# EAGLE schematic bitfury_h-card-v1.2 (EAGLE 6.2)

## Sheet 1 of 3
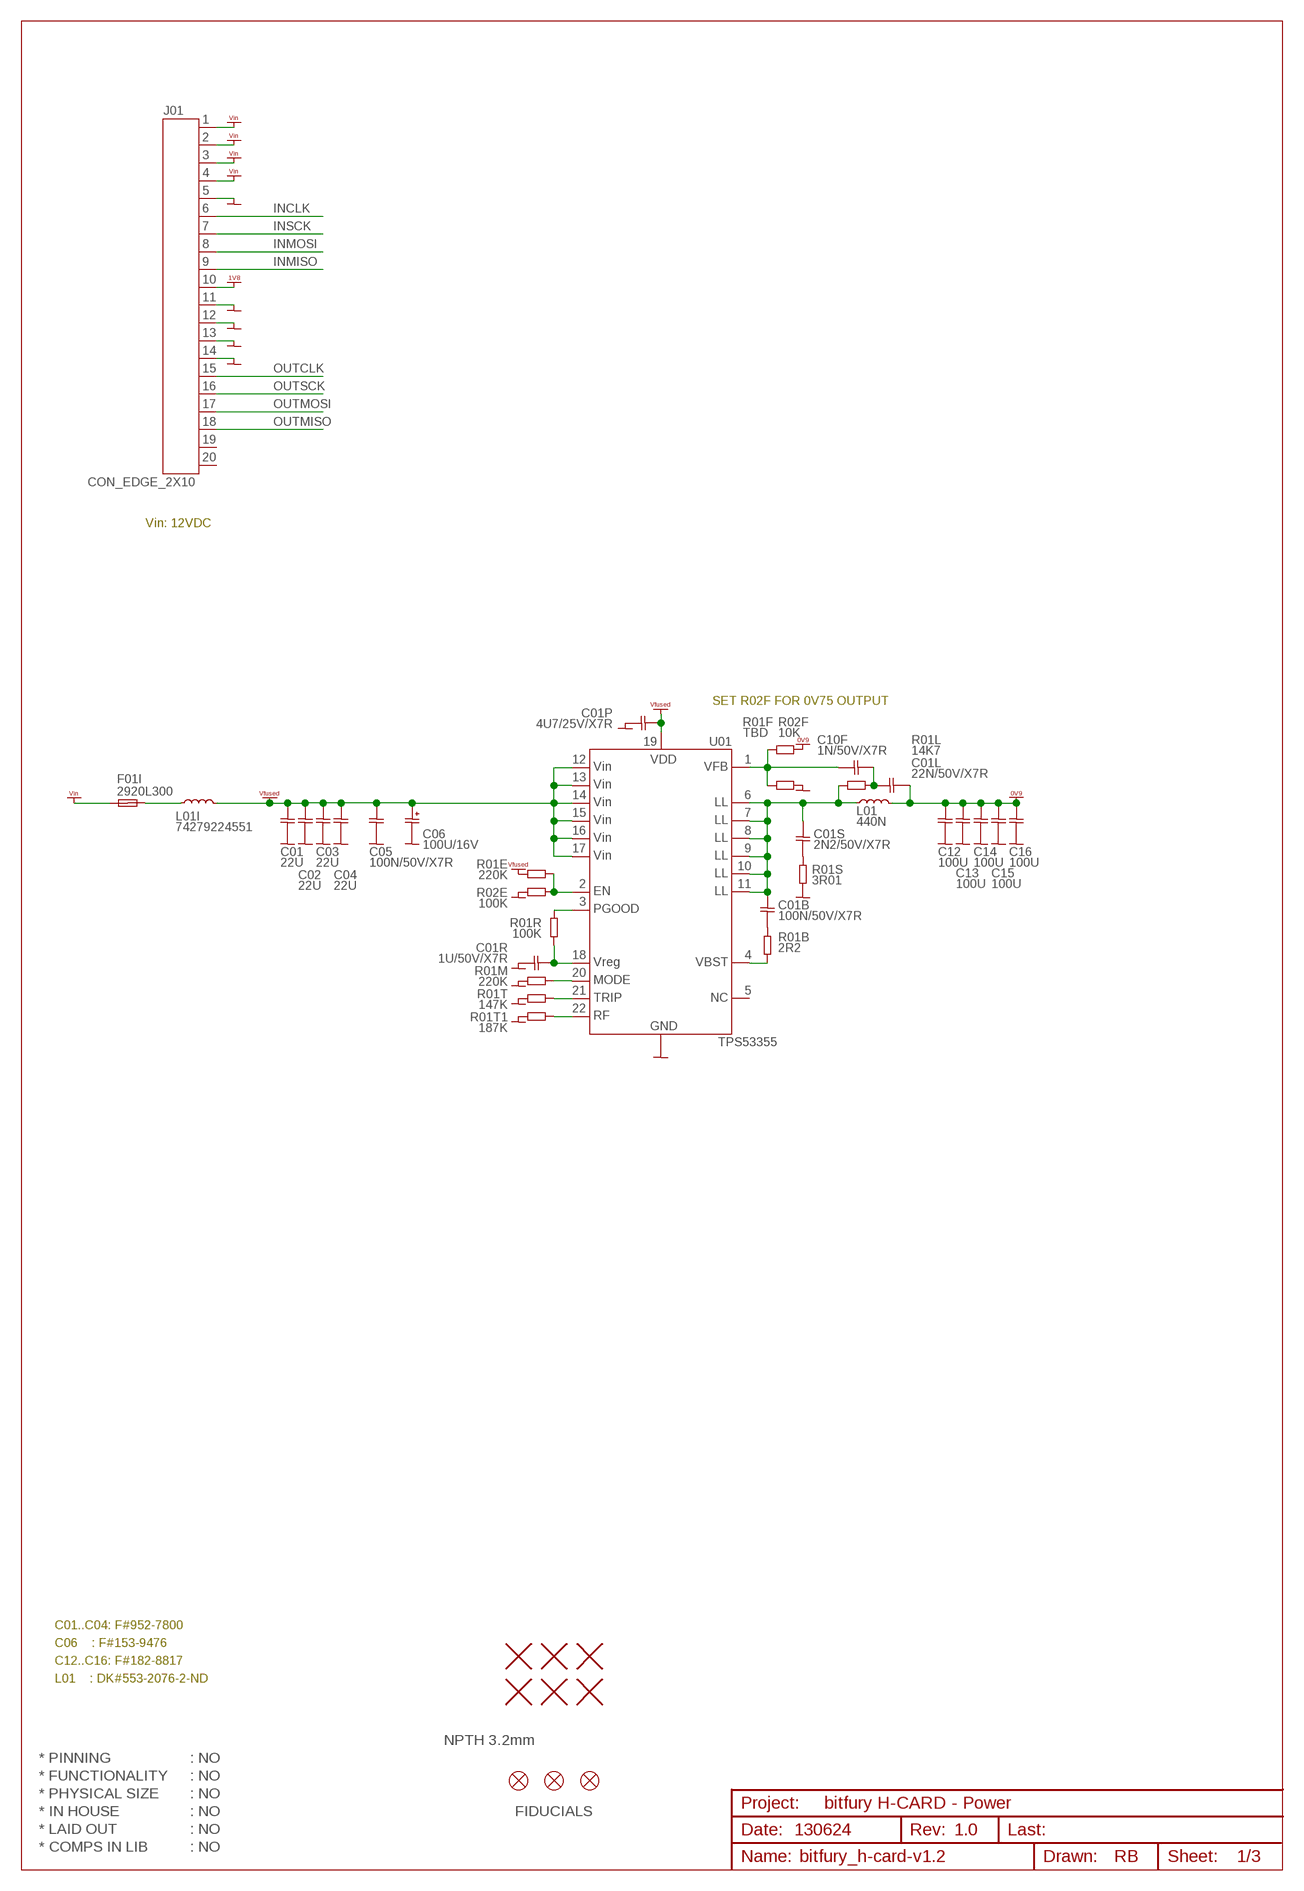
[diagram p0: schematic, sheet 1]

### Parts
C01  22U  CAP1210  [CAP1210]
C01B  100N/50V/X7R  CAP0603  [CAP0603]
C01L  22N/50V/X7R  CAP0603  [CAP0603]
C01P  4U7/25V/X7R  CAP0805  [CAP0805]
C01R  1U/50V/X7R  CAP0603  [CAP0603]
C01S  2N2/50V/X7R  CAP0603  [CAP0603]
C02  22U  CAP1210  [CAP1210]
C03  22U  CAP1210  [CAP1210]
C04  22U  CAP1210  [CAP1210]
C05  100N/50V/X7R  CAP0603  [CAP0603]
C06  100U/16V  ECAP_CASED  [ECAP_CASED]
C10F  1N/50V/X7R  CAP0603  [CAP0603]
C12  100U  CAP1210  [CAP1210]
C13  100U  CAP1210  [CAP1210]
C14  100U  CAP1210  [CAP1210]
C15  100U  CAP1210  [CAP1210]
C16  100U  CAP1210  [CAP1210]
F01I  2920L300  POLYFUSE2920  [POLYFUSE2920]
FI1  FIDUCIAL1.5X3  [FIDUCIAL-1.5X3]
FI2  FIDUCIAL1.5X3  [FIDUCIAL-1.5X3]
FI3  FIDUCIAL1.5X3  [FIDUCIAL-1.5X3]
H1  HOLE_NPTH_3.2MM  [HOLE_NPTH_3.2MM]
H2  HOLE_NPTH_3.2MM  [HOLE_NPTH_3.2MM]
H3  HOLE_NPTH_3.2MM  [HOLE_NPTH_3.2MM]
H4  HOLE_NPTH_3.2MM  [HOLE_NPTH_3.2MM]
H5  HOLE_NPTH_3.2MM  [HOLE_NPTH_3.2MM]
H6  HOLE_NPTH_3.2MM  [HOLE_NPTH_3.2MM]
J01  CON_EDGE_2X10  [CON_EDGE_2X10]
L01  440N  PA0513.441NLT  [PA0513.441NLT]
L01I  74279224551  L2220  [L2220]
R01B  2R2  RES0603  [RES0603]
R01E  220K  RES0603  [RES0603]
R01F  TBD  RES0603  [RES0603]
R01L  14K7  RES0603  [RES0603]
R01M  220K  RES0603  [RES0603]
R01R  100K  RES0603  [RES0603]
R01S  3R01  RES0805  [RES0805]
R01T  147K  RES0603  [RES0603]
R01T1  187K  RES0603  [RES0603]
R02E  100K  RES0603  [RES0603]
R02F  10K  RES0603  [RES0603]
U01  TPS53355  [DQP22]

### Nets
EN: R01E.1 R02E.1 U01.2(2.EN)
GND: C01.2 C01P.2 C01R.2 C02.2 C03.2 C04.2 C05.2 C06.- C12.2 C13.2 C14.2 C15.2 C16.2 J01.A5 J01.B1 J01.B2 J01.B3 J01.B4 R01M.2 R01S.2 R01T1.2 R01T.2 R02E.2 R02F.2 U01.HS(PP.GND) U01.V1(PP.GND) U01.V2(PP.GND) U01.V4(PP.GND) U01.V6(PP.GND) U01.V7(PP.GND) U01.V8(PP.GND) U01.V9(PP.GND) U01.V10(PP.GND) U01.V11(PP.GND) U01.V13(PP.GND) U01.V15(PP.GND) U01.V16(PP.GND) U01.V17(PP.GND) U01.V18(PP.GND) U01.V19(PP.GND) U01.V20(PP.GND) U01.V23(PP.GND) U01.V24(PP.GND) U01.V25(PP.GND) U01.V26(PP.GND) U01.V27(PP.GND) ; also sheet 2,3
INCLK: J01.A6 ; also sheet 2
INMISO: J01.A9 ; also sheet 2
INMOSI: J01.A8 ; also sheet 2
INSCK: J01.A7 ; also sheet 2
LL: C01B.1 C01S.1 L01.1 R01L.1 U01.6(6.LL) U01.7(7.LL) U01.8(8.LL) U01.9(9.LL) U01.10(10.LL) U01.11(11.LL)
MODE: R01M.1 U01.20(20.MODE)
N$1: F01I.2 L01I.1
N$10: C01B.2 R01B.1
N$23: C01L.1 C10F.2 R01L.2
N$25: C01S.2 R01S.1
OUTCLK: J01.B5 ; also sheet 2
OUTMISO: J01.B8 ; also sheet 2
OUTMOSI: J01.B7 ; also sheet 2
OUTSCK: J01.B6 ; also sheet 2
PGOOD: R01R.1 U01.3(3.PGOOD)
RF: R01T1.1 U01.22(22.RF)
TRIP: R01T.1 U01.21(21.TRIP)
VBST: R01B.2 U01.4(4.VBST)
VDD_0V9: C01L.2 C12.1 C13.1 C14.1 C15.1 C16.1 L01.2 R01F.2 ; supply symbol labelled VCC_0V9 ; also sheet 2,3
VDD_1V8: J01.A10 ; supply symbol labelled VCC_1V8 ; also sheet 2
VDD_POWER-IN: F01I.1 J01.A1 J01.A2 J01.A3 J01.A4 ; supply symbol labelled VCC_POWER-IN
VDD_POWER-IN_FUSED: C01.1 C01P.1 C02.1 C03.1 C04.1 C05.1 C06.+ L01I.2 R01E.2 U01.12(12.VIN) U01.13(13.VIN) U01.14(14.VIN) U01.15(15.VIN) U01.16(16.VIN) U01.17(17.VIN) U01.19(19.VDD) ; supply symbol labelled VCC_POWER-IN_FUSED
VFB: C10F.1 R01F.1 R02F.1 U01.1(1.VFB)
VREG: C01R.1 R01R.2 U01.18(18.VREG)
Unconnected: J01.B9 J01.B10 U01.5(5.NC)

### Notes on the sheet
- Vin: 12VDC
- SET R02F FOR 0V75 OUTPUT
- C01..C04: F#952-7800
- C06    : F#153-9476
- C12..C16: F#182-8817
- L01    : DK#553-2076-2-ND
- NPTH 3.2mm
- * PINNING | : NO
- * FUNCTIONALITY | : NO
- * PHYSICAL SIZE | : NO
- bitfury H-CARD - Power
- * IN HOUSE | : NO | FIDUCIALS
- * LAID OUT | : NO | 130624 | 1.0
- * COMPS IN LIB | : NO

## Sheet 2 of 3
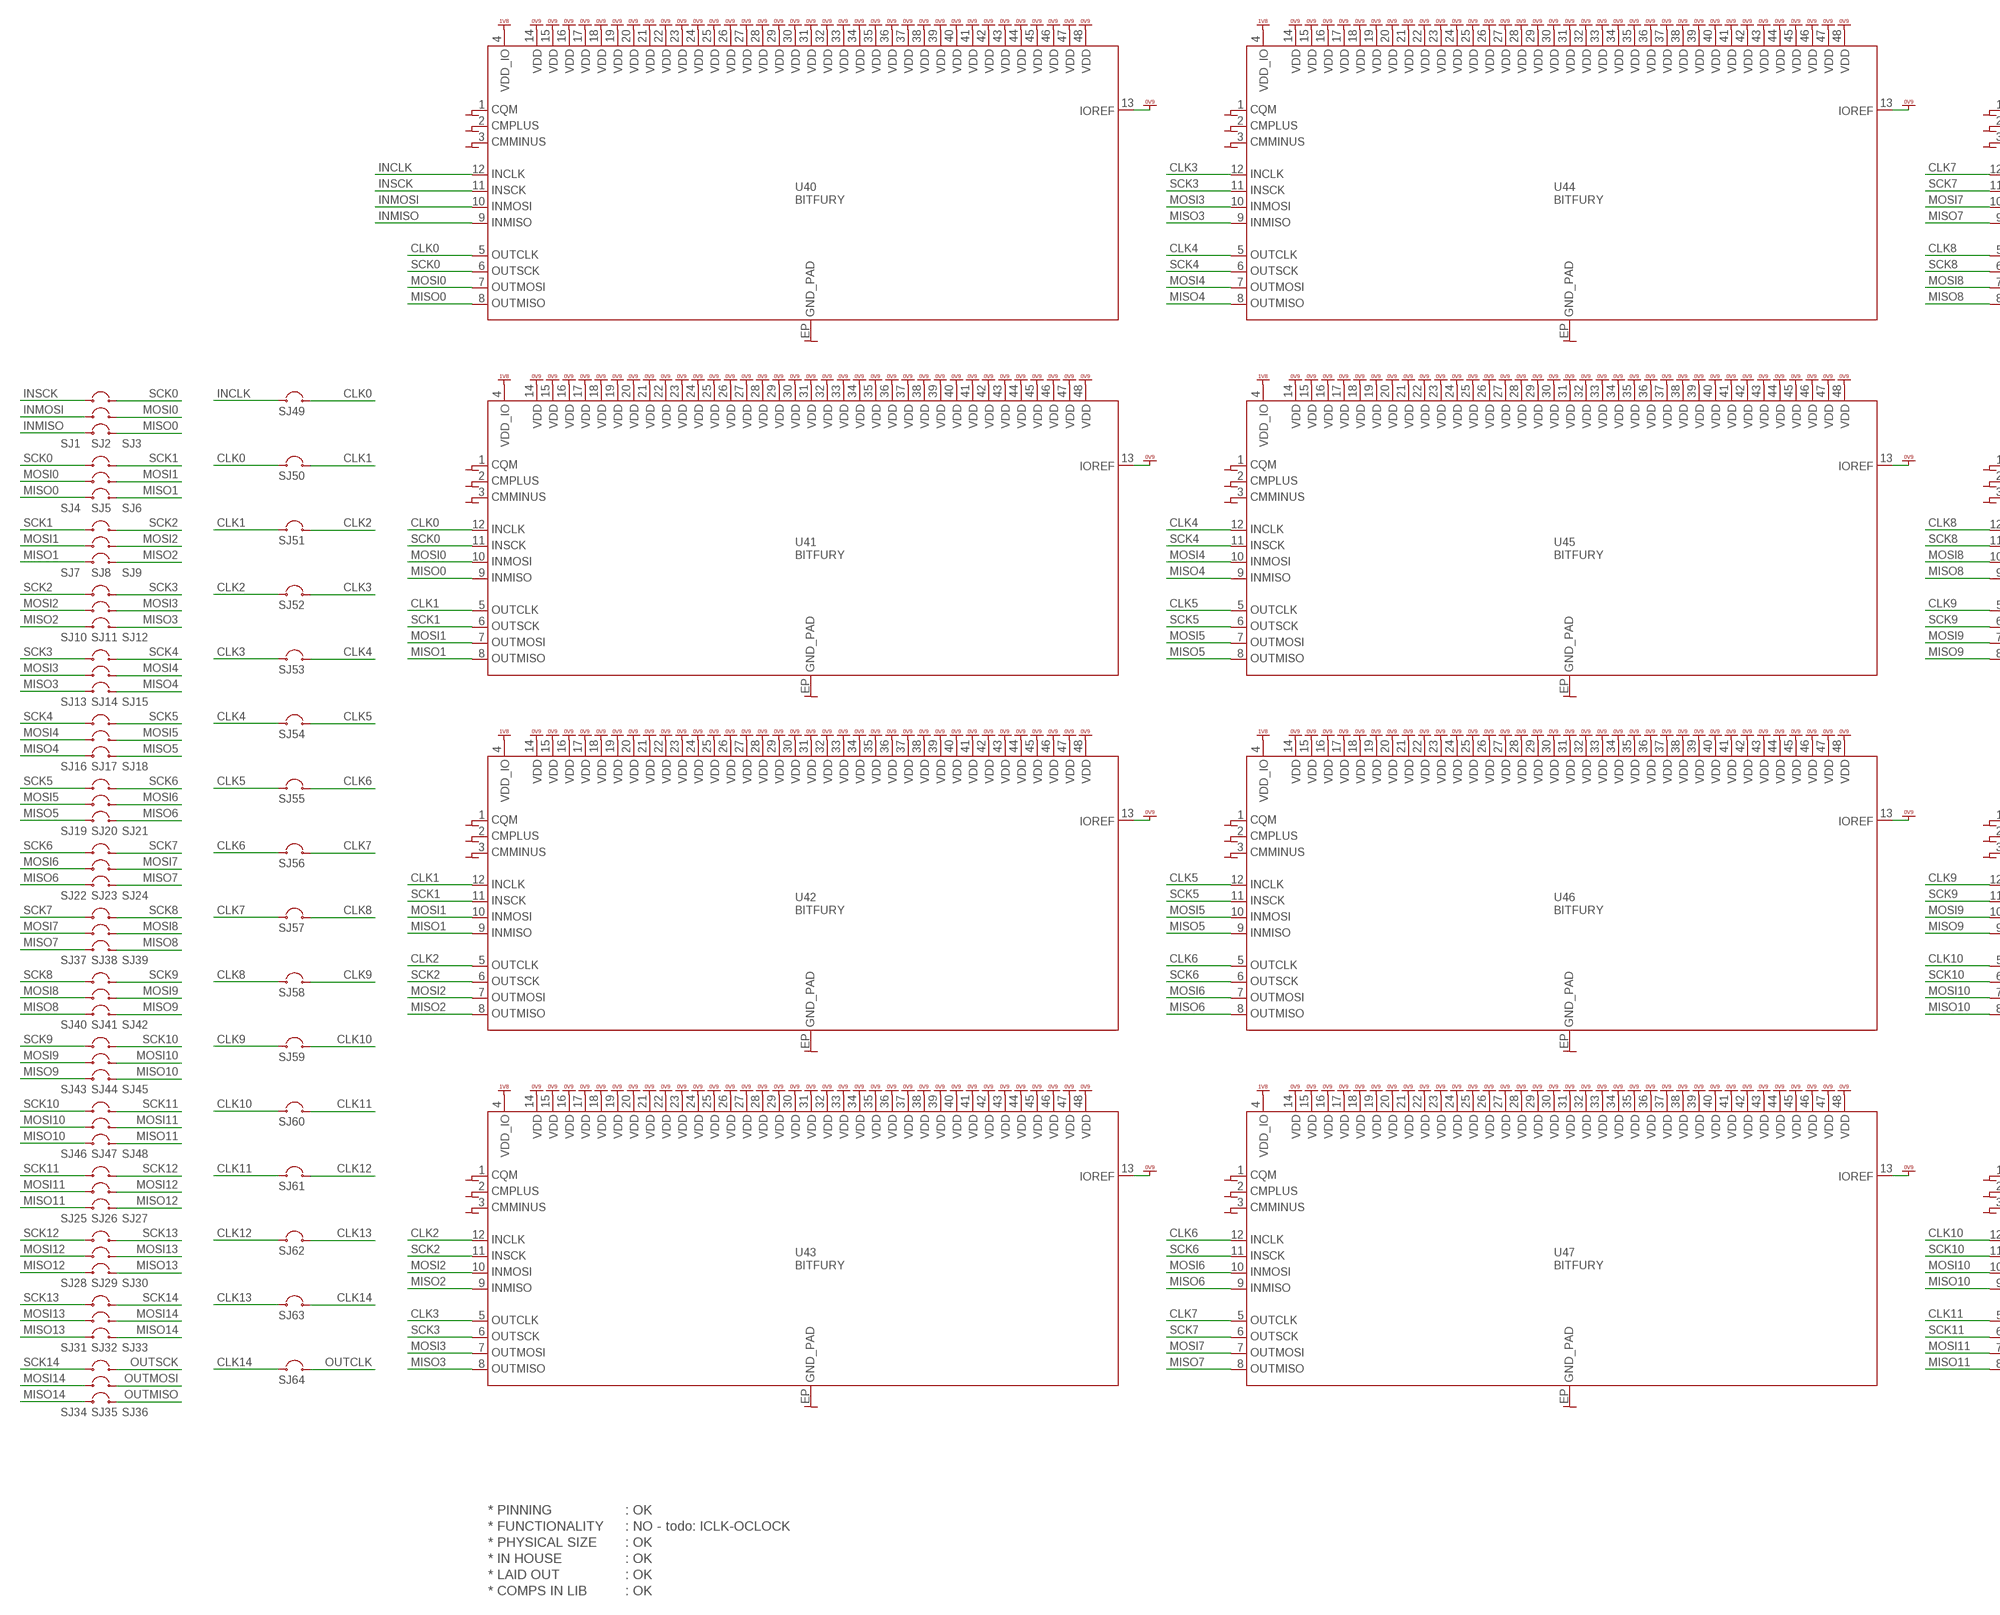
[diagram p1: schematic, sheet 2, part 1 of 2]
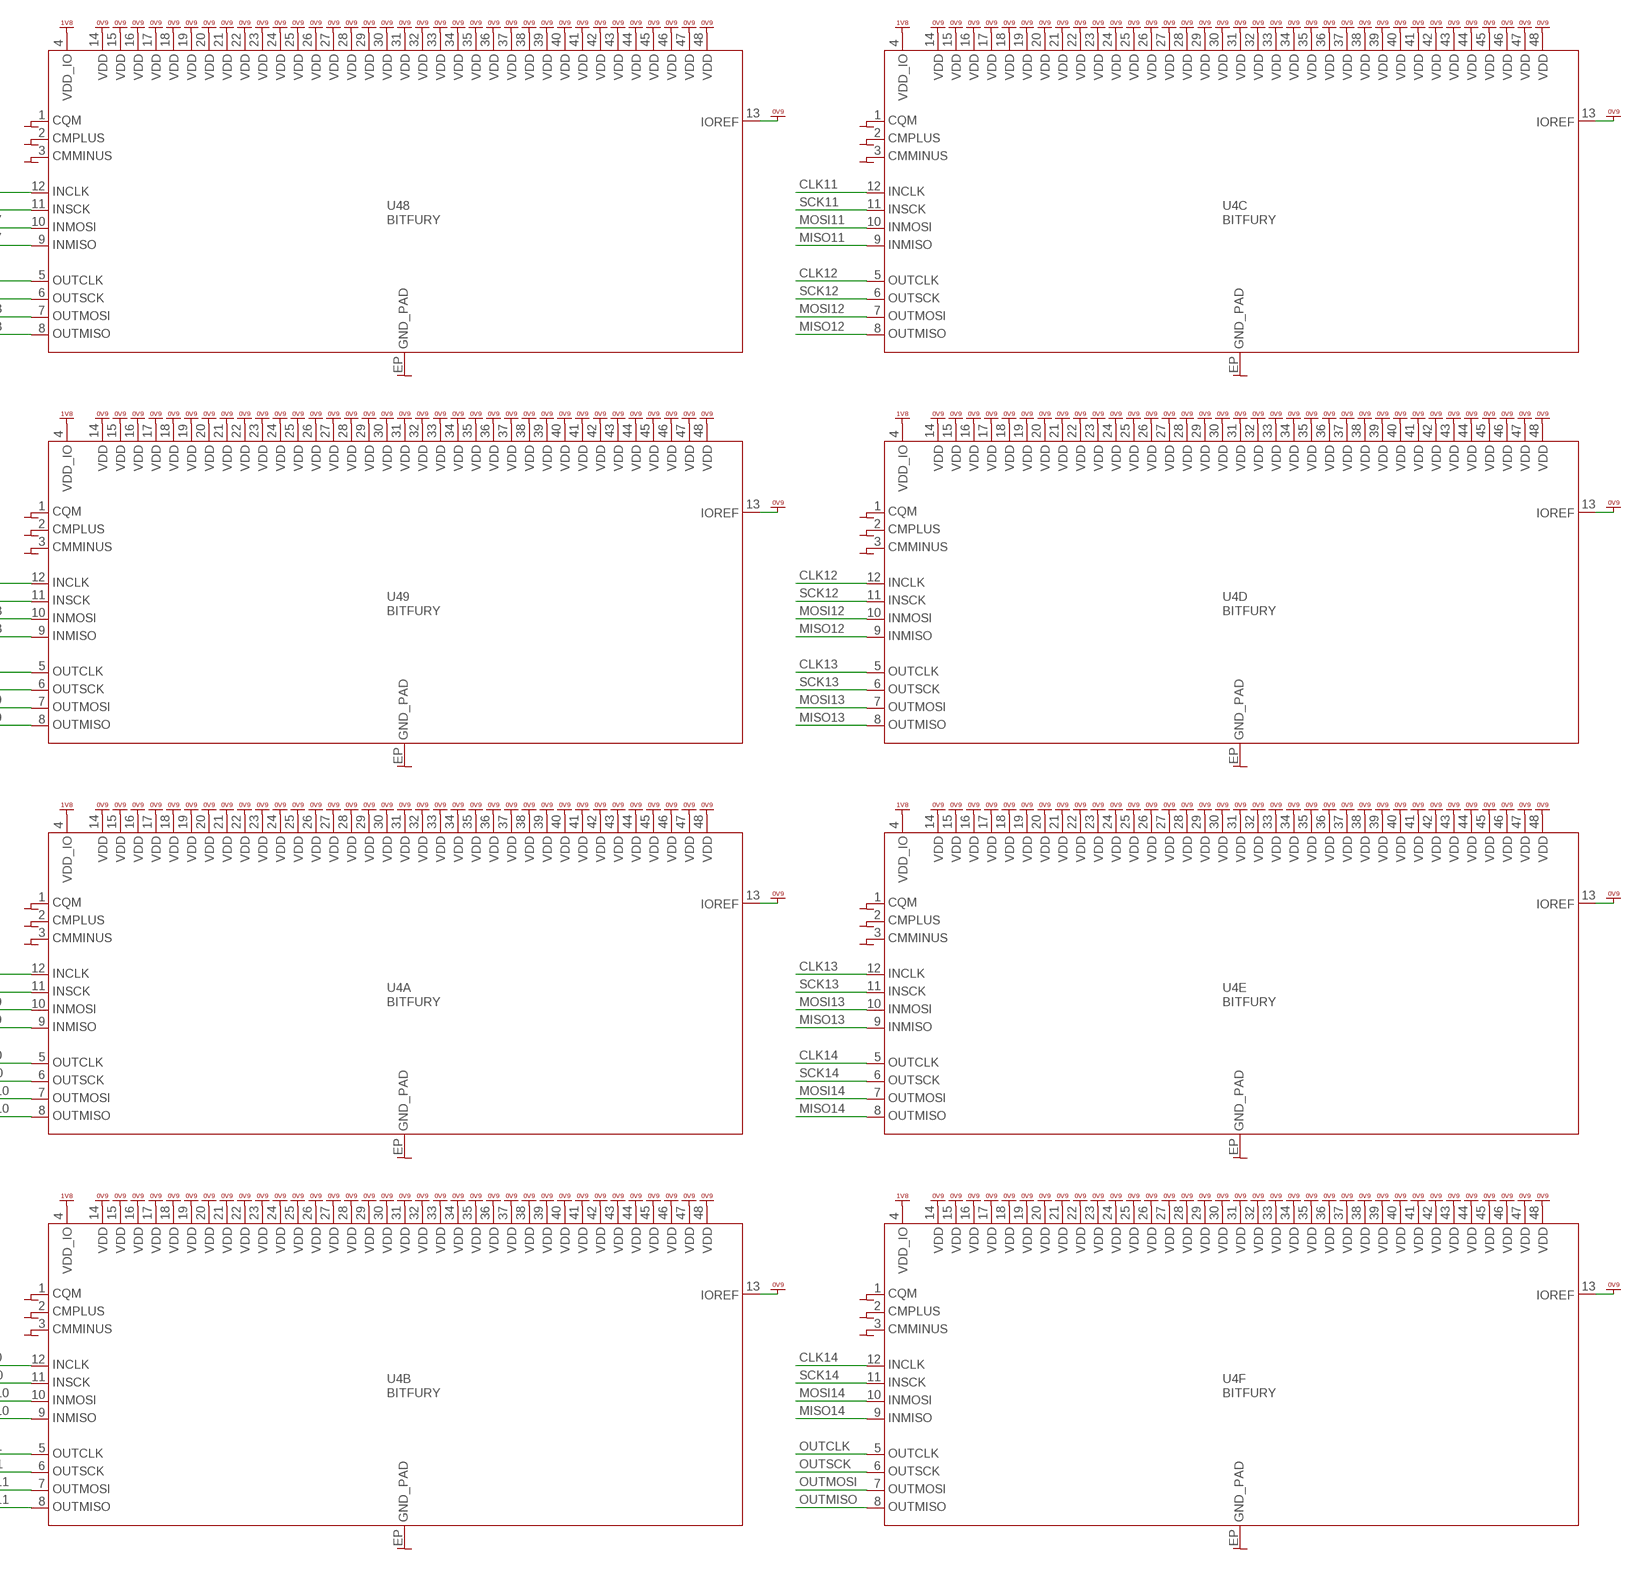
[diagram p2: schematic, sheet 2, part 2 of 2]

### Parts
SJ1  SJ2SJ2-S  [SJ2-S]
SJ2  SJ2SJ2-S  [SJ2-S]
SJ3  SJ2SJ2-S  [SJ2-S]
SJ4  SJ2SJ2-S  [SJ2-S]
SJ5  SJ2SJ2-S  [SJ2-S]
SJ6  SJ2SJ2-S  [SJ2-S]
SJ7  SJ2SJ2-S  [SJ2-S]
SJ8  SJ2SJ2-S  [SJ2-S]
SJ9  SJ2SJ2-S  [SJ2-S]
SJ10  SJ2SJ2-S  [SJ2-S]
SJ11  SJ2SJ2-S  [SJ2-S]
SJ12  SJ2SJ2-S  [SJ2-S]
SJ13  SJ2SJ2-S  [SJ2-S]
SJ14  SJ2SJ2-S  [SJ2-S]
SJ15  SJ2SJ2-S  [SJ2-S]
SJ16  SJ2SJ2-S  [SJ2-S]
SJ17  SJ2SJ2-S  [SJ2-S]
SJ18  SJ2SJ2-S  [SJ2-S]
SJ19  SJ2SJ2-S  [SJ2-S]
SJ20  SJ2SJ2-S  [SJ2-S]
SJ21  SJ2SJ2-S  [SJ2-S]
SJ22  SJ2SJ2-S  [SJ2-S]
SJ23  SJ2SJ2-S  [SJ2-S]
SJ24  SJ2SJ2-S  [SJ2-S]
SJ25  SJ2SJ2-S  [SJ2-S]
SJ26  SJ2SJ2-S  [SJ2-S]
SJ27  SJ2SJ2-S  [SJ2-S]
SJ28  SJ2SJ2-S  [SJ2-S]
SJ29  SJ2SJ2-S  [SJ2-S]
SJ30  SJ2SJ2-S  [SJ2-S]
SJ31  SJ2SJ2-S  [SJ2-S]
SJ32  SJ2SJ2-S  [SJ2-S]
SJ33  SJ2SJ2-S  [SJ2-S]
SJ34  SJ2SJ2-S  [SJ2-S]
SJ35  SJ2SJ2-S  [SJ2-S]
SJ36  SJ2SJ2-S  [SJ2-S]
SJ37  SJ2SJ2-S  [SJ2-S]
SJ38  SJ2SJ2-S  [SJ2-S]
SJ39  SJ2SJ2-S  [SJ2-S]
SJ40  SJ2SJ2-S  [SJ2-S]
SJ41  SJ2SJ2-S  [SJ2-S]
SJ42  SJ2SJ2-S  [SJ2-S]
SJ43  SJ2SJ2-S  [SJ2-S]
SJ44  SJ2SJ2-S  [SJ2-S]
SJ45  SJ2SJ2-S  [SJ2-S]
SJ46  SJ2SJ2-S  [SJ2-S]
SJ47  SJ2SJ2-S  [SJ2-S]
SJ48  SJ2SJ2-S  [SJ2-S]
SJ49  SJ2SJ2-S  [SJ2-S]
SJ50  SJ2SJ2-S  [SJ2-S]
SJ51  SJ2SJ2-S  [SJ2-S]
SJ52  SJ2SJ2-S  [SJ2-S]
SJ53  SJ2SJ2-S  [SJ2-S]
SJ54  SJ2SJ2-S  [SJ2-S]
SJ55  SJ2SJ2-S  [SJ2-S]
SJ56  SJ2SJ2-S  [SJ2-S]
SJ57  SJ2SJ2-S  [SJ2-S]
SJ58  SJ2SJ2-S  [SJ2-S]
SJ59  SJ2SJ2-S  [SJ2-S]
SJ60  SJ2SJ2-S  [SJ2-S]
SJ61  SJ2SJ2-S  [SJ2-S]
SJ62  SJ2SJ2-S  [SJ2-S]
SJ63  SJ2SJ2-S  [SJ2-S]
SJ64  SJ2SJ2-S  [SJ2-S]
U4A  BITFURY  [QNF48]
U4B  BITFURY  [QNF48]
U4C  BITFURY  [QNF48]
U4D  BITFURY  [QNF48]
U4E  BITFURY  [QNF48]
U4F  BITFURY  [QNF48]
U40  BITFURY  [QNF48]
U41  BITFURY  [QNF48]
U42  BITFURY  [QNF48]
U43  BITFURY  [QNF48]
U44  BITFURY  [QNF48]
U45  BITFURY  [QNF48]
U46  BITFURY  [QNF48]
U47  BITFURY  [QNF48]
U48  BITFURY  [QNF48]
U49  BITFURY  [QNF48]

### Nets
CLK0: SJ49.2 SJ50.1 U40.5(5.OUTCLK) U41.12(12.INCLK)
CLK1: SJ50.2 SJ51.1 U41.5(5.OUTCLK) U42.12(12.INCLK)
CLK2: SJ51.2 SJ52.1 U42.5(5.OUTCLK) U43.12(12.INCLK)
CLK3: SJ52.2 SJ53.1 U43.5(5.OUTCLK) U44.12(12.INCLK)
CLK4: SJ53.2 SJ54.1 U44.5(5.OUTCLK) U45.12(12.INCLK)
CLK5: SJ54.2 SJ55.1 U45.5(5.OUTCLK) U46.12(12.INCLK)
CLK6: SJ55.2 SJ56.1 U46.5(5.OUTCLK) U47.12(12.INCLK)
CLK7: SJ56.2 SJ57.1 U47.5(5.OUTCLK) U48.12(12.INCLK)
CLK8: SJ57.2 SJ58.1 U48.5(5.OUTCLK) U49.12(12.INCLK)
CLK9: SJ58.2 SJ59.1 U4A.12(12.INCLK) U49.5(5.OUTCLK)
CLK10: SJ59.2 SJ60.1 U4A.5(5.OUTCLK) U4B.12(12.INCLK)
CLK11: SJ60.2 SJ61.1 U4B.5(5.OUTCLK) U4C.12(12.INCLK)
CLK12: SJ61.2 SJ62.1 U4C.5(5.OUTCLK) U4D.12(12.INCLK)
CLK13: SJ62.2 SJ63.1 U4D.5(5.OUTCLK) U4E.12(12.INCLK)
CLK14: SJ63.2 SJ64.1 U4E.5(5.OUTCLK) U4F.12(12.INCLK)
GND: U4A.1(1.QCM) U4A.2(2.CMPLUS) U4A.3(3.CMMINUS) U4A.EP(EP.VSS_EP) U4A.V1(EP.VSS_EP) U4A.V2(EP.VSS_EP) U4A.V3(EP.VSS_EP) U4A.V4(EP.VSS_EP) U4A.V5(EP.VSS_EP) U4A.V6(EP.VSS_EP) U4A.V7(EP.VSS_EP) U4A.V8(EP.VSS_EP) U4A.V9(EP.VSS_EP) U4A.V10(EP.VSS_EP) U4A.V11(EP.VSS_EP) U4A.V12(EP.VSS_EP) U4A.V13(EP.VSS_EP) U4A.V14(EP.VSS_EP) U4A.V15(EP.VSS_EP) U4A.V16(EP.VSS_EP) U4A.V17(EP.VSS_EP) U4A.V18(EP.VSS_EP) U4A.V19(EP.VSS_EP) U4A.V20(EP.VSS_EP) U4A.V21(EP.VSS_EP) U4A.V22(EP.VSS_EP) U4A.V23(EP.VSS_EP) U4A.V24(EP.VSS_EP) U4A.V25(EP.VSS_EP) U4B.1(1.QCM) U4B.2(2.CMPLUS) U4B.3(3.CMMINUS) U4B.EP(EP.VSS_EP) U4B.V1(EP.VSS_EP) U4B.V2(EP.VSS_EP) U4B.V3(EP.VSS_EP) U4B.V4(EP.VSS_EP) U4B.V5(EP.VSS_EP) U4B.V6(EP.VSS_EP) U4B.V7(EP.VSS_EP) U4B.V8(EP.VSS_EP) U4B.V9(EP.VSS_EP) U4B.V10(EP.VSS_EP) U4B.V11(EP.VSS_EP) U4B.V12(EP.VSS_EP) U4B.V13(EP.VSS_EP) U4B.V14(EP.VSS_EP) U4B.V15(EP.VSS_EP) U4B.V16(EP.VSS_EP) U4B.V17(EP.VSS_EP) U4B.V18(EP.VSS_EP) U4B.V19(EP.VSS_EP) U4B.V20(EP.VSS_EP) U4B.V21(EP.VSS_EP) U4B.V22(EP.VSS_EP) U4B.V23(EP.VSS_EP) U4B.V24(EP.VSS_EP) U4B.V25(EP.VSS_EP) U4C.1(1.QCM) U4C.2(2.CMPLUS) U4C.3(3.CMMINUS) U4C.EP(EP.VSS_EP) U4C.V1(EP.VSS_EP) U4C.V2(EP.VSS_EP) U4C.V3(EP.VSS_EP) U4C.V4(EP.VSS_EP) U4C.V5(EP.VSS_EP) U4C.V6(EP.VSS_EP) U4C.V7(EP.VSS_EP) U4C.V8(EP.VSS_EP) U4C.V9(EP.VSS_EP) U4C.V10(EP.VSS_EP) U4C.V11(EP.VSS_EP) U4C.V12(EP.VSS_EP) U4C.V13(EP.VSS_EP) U4C.V14(EP.VSS_EP) U4C.V15(EP.VSS_EP) U4C.V16(EP.VSS_EP) U4C.V17(EP.VSS_EP) U4C.V18(EP.VSS_EP) U4C.V19(EP.VSS_EP) U4C.V20(EP.VSS_EP) U4C.V21(EP.VSS_EP) U4C.V22(EP.VSS_EP) U4C.V23(EP.VSS_EP) U4C.V24(EP.VSS_EP) U4C.V25(EP.VSS_EP) U4D.1(1.QCM) U4D.2(2.CMPLUS) U4D.3(3.CMMINUS) U4D.EP(EP.VSS_EP) U4D.V1(EP.VSS_EP) U4D.V2(EP.VSS_EP) U4D.V3(EP.VSS_EP) U4D.V4(EP.VSS_EP) U4D.V5(EP.VSS_EP) U4D.V6(EP.VSS_EP) U4D.V7(EP.VSS_EP) U4D.V8(EP.VSS_EP) U4D.V9(EP.VSS_EP) U4D.V10(EP.VSS_EP) U4D.V11(EP.VSS_EP) U4D.V12(EP.VSS_EP) U4D.V13(EP.VSS_EP) U4D.V14(EP.VSS_EP) U4D.V15(EP.VSS_EP) U4D.V16(EP.VSS_EP) U4D.V17(EP.VSS_EP) U4D.V18(EP.VSS_EP) U4D.V19(EP.VSS_EP) U4D.V20(EP.VSS_EP) U4D.V21(EP.VSS_EP) U4D.V22(EP.VSS_EP) U4D.V23(EP.VSS_EP) U4D.V24(EP.VSS_EP) U4D.V25(EP.VSS_EP) U4E.1(1.QCM) U4E.2(2.CMPLUS) U4E.3(3.CMMINUS) U4E.EP(EP.VSS_EP) U4E.V1(EP.VSS_EP) U4E.V2(EP.VSS_EP) U4E.V3(EP.VSS_EP) U4E.V4(EP.VSS_EP) U4E.V5(EP.VSS_EP) U4E.V6(EP.VSS_EP) U4E.V7(EP.VSS_EP) U4E.V8(EP.VSS_EP) U4E.V9(EP.VSS_EP) U4E.V10(EP.VSS_EP) U4E.V11(EP.VSS_EP) U4E.V12(EP.VSS_EP) U4E.V13(EP.VSS_EP) U4E.V14(EP.VSS_EP) U4E.V15(EP.VSS_EP) U4E.V16(EP.VSS_EP) U4E.V17(EP.VSS_EP) U4E.V18(EP.VSS_EP) U4E.V19(EP.VSS_EP) U4E.V20(EP.VSS_EP) U4E.V21(EP.VSS_EP) U4E.V22(EP.VSS_EP) U4E.V23(EP.VSS_EP) U4E.V24(EP.VSS_EP) U4E.V25(EP.VSS_EP) U4F.1(1.QCM) U4F.2(2.CMPLUS) U4F.3(3.CMMINUS) U4F.EP(EP.VSS_EP) U4F.V1(EP.VSS_EP) U4F.V2(EP.VSS_EP) U4F.V3(EP.VSS_EP) U4F.V4(EP.VSS_EP) U4F.V5(EP.VSS_EP) U4F.V6(EP.VSS_EP) U4F.V7(EP.VSS_EP) U4F.V8(EP.VSS_EP) U4F.V9(EP.VSS_EP) U4F.V10(EP.VSS_EP) U4F.V11(EP.VSS_EP) U4F.V12(EP.VSS_EP) U4F.V13(EP.VSS_EP) U4F.V14(EP.VSS_EP) U4F.V15(EP.VSS_EP) U4F.V16(EP.VSS_EP) U4F.V17(EP.VSS_EP) U4F.V18(EP.VSS_EP) U4F.V19(EP.VSS_EP) U4F.V20(EP.VSS_EP) U4F.V21(EP.VSS_EP) U4F.V22(EP.VSS_EP) U4F.V23(EP.VSS_EP) U4F.V24(EP.VSS_EP) U4F.V25(EP.VSS_EP) U40.1(1.QCM) U40.2(2.CMPLUS) U40.3(3.CMMINUS) U40.EP(EP.VSS_EP) U40.V1(EP.VSS_EP) U40.V2(EP.VSS_EP) U40.V3(EP.VSS_EP) U40.V4(EP.VSS_EP) U40.V5(EP.VSS_EP) U40.V6(EP.VSS_EP) U40.V7(EP.VSS_EP) U40.V8(EP.VSS_EP) U40.V9(EP.VSS_EP) U40.V10(EP.VSS_EP) U40.V11(EP.VSS_EP) U40.V12(EP.VSS_EP) U40.V13(EP.VSS_EP) U40.V14(EP.VSS_EP) U40.V15(EP.VSS_EP) U40.V16(EP.VSS_EP) U40.V17(EP.VSS_EP) U40.V18(EP.VSS_EP) U40.V19(EP.VSS_EP) U40.V20(EP.VSS_EP) U40.V21(EP.VSS_EP) U40.V22(EP.VSS_EP) U40.V23(EP.VSS_EP) U40.V24(EP.VSS_EP) U40.V25(EP.VSS_EP) U41.1(1.QCM) U41.2(2.CMPLUS) U41.3(3.CMMINUS) U41.EP(EP.VSS_EP) U41.V1(EP.VSS_EP) U41.V2(EP.VSS_EP) U41.V3(EP.VSS_EP) U41.V4(EP.VSS_EP) U41.V5(EP.VSS_EP) U41.V6(EP.VSS_EP) U41.V7(EP.VSS_EP) U41.V8(EP.VSS_EP) U41.V9(EP.VSS_EP) U41.V10(EP.VSS_EP) U41.V11(EP.VSS_EP) U41.V12(EP.VSS_EP) U41.V13(EP.VSS_EP) U41.V14(EP.VSS_EP) U41.V15(EP.VSS_EP) U41.V16(EP.VSS_EP) U41.V17(EP.VSS_EP) U41.V18(EP.VSS_EP) U41.V19(EP.VSS_EP) U41.V20(EP.VSS_EP) U41.V21(EP.VSS_EP) U41.V22(EP.VSS_EP) U41.V23(EP.VSS_EP) U41.V24(EP.VSS_EP) U41.V25(EP.VSS_EP) U42.1(1.QCM) U42.2(2.CMPLUS) U42.3(3.CMMINUS) U42.EP(EP.VSS_EP) U42.V1(EP.VSS_EP) U42.V2(EP.VSS_EP) U42.V3(EP.VSS_EP) U42.V4(EP.VSS_EP) U42.V5(EP.VSS_EP) U42.V6(EP.VSS_EP) U42.V7(EP.VSS_EP) U42.V8(EP.VSS_EP) U42.V9(EP.VSS_EP) U42.V10(EP.VSS_EP) U42.V11(EP.VSS_EP) U42.V12(EP.VSS_EP) U42.V13(EP.VSS_EP) U42.V14(EP.VSS_EP) U42.V15(EP.VSS_EP) U42.V16(EP.VSS_EP) U42.V17(EP.VSS_EP) U42.V18(EP.VSS_EP) U42.V19(EP.VSS_EP) U42.V20(EP.VSS_EP) U42.V21(EP.VSS_EP) U42.V22(EP.VSS_EP) U42.V23(EP.VSS_EP) U42.V24(EP.VSS_EP) U42.V25(EP.VSS_EP) U43.1(1.QCM) U43.2(2.CMPLUS) U43.3(3.CMMINUS) U43.EP(EP.VSS_EP) U43.V1(EP.VSS_EP) U43.V2(EP.VSS_EP) U43.V3(EP.VSS_EP) U43.V4(EP.VSS_EP) U43.V5(EP.VSS_EP) U43.V6(EP.VSS_EP) U43.V7(EP.VSS_EP) U43.V8(EP.VSS_EP) U43.V9(EP.VSS_EP) U43.V10(EP.VSS_EP) U43.V11(EP.VSS_EP) U43.V12(EP.VSS_EP) U43.V13(EP.VSS_EP) U43.V14(EP.VSS_EP) U43.V15(EP.VSS_EP) U43.V16(EP.VSS_EP) U43.V17(EP.VSS_EP) U43.V18(EP.VSS_EP) U43.V19(EP.VSS_EP) U43.V20(EP.VSS_EP) U43.V21(EP.VSS_EP) U43.V22(EP.VSS_EP) U43.V23(EP.VSS_EP) U43.V24(EP.VSS_EP) U43.V25(EP.VSS_EP) U44.1(1.QCM) U44.2(2.CMPLUS) U44.3(3.CMMINUS) U44.EP(EP.VSS_EP) U44.V1(EP.VSS_EP) U44.V2(EP.VSS_EP) U44.V3(EP.VSS_EP) U44.V4(EP.VSS_EP) U44.V5(EP.VSS_EP) U44.V6(EP.VSS_EP) U44.V7(EP.VSS_EP) U44.V8(EP.VSS_EP) U44.V9(EP.VSS_EP) U44.V10(EP.VSS_EP) U44.V11(EP.VSS_EP) U44.V12(EP.VSS_EP) U44.V13(EP.VSS_EP) U44.V14(EP.VSS_EP) U44.V15(EP.VSS_EP) U44.V16(EP.VSS_EP) U44.V17(EP.VSS_EP) U44.V18(EP.VSS_EP) U44.V19(EP.VSS_EP) U44.V20(EP.VSS_EP) U44.V21(EP.VSS_EP) U44.V22(EP.VSS_EP) U44.V23(EP.VSS_EP) U44.V24(EP.VSS_EP) U44.V25(EP.VSS_EP) U45.1(1.QCM) U45.2(2.CMPLUS) U45.3(3.CMMINUS) U45.EP(EP.VSS_EP) U45.V1(EP.VSS_EP) U45.V2(EP.VSS_EP) U45.V3(EP.VSS_EP) U45.V4(EP.VSS_EP) U45.V5(EP.VSS_EP) U45.V6(EP.VSS_EP) U45.V7(EP.VSS_EP) U45.V8(EP.VSS_EP) U45.V9(EP.VSS_EP) U45.V10(EP.VSS_EP) U45.V11(EP.VSS_EP) U45.V12(EP.VSS_EP) U45.V13(EP.VSS_EP) U45.V14(EP.VSS_EP) U45.V15(EP.VSS_EP) U45.V16(EP.VSS_EP) U45.V17(EP.VSS_EP) U45.V18(EP.VSS_EP) U45.V19(EP.VSS_EP) U45.V20(EP.VSS_EP) U45.V21(EP.VSS_EP) U45.V22(EP.VSS_EP) U45.V23(EP.VSS_EP) U45.V24(EP.VSS_EP) U45.V25(EP.VSS_EP) U46.1(1.QCM) U46.2(2.CMPLUS) U46.3(3.CMMINUS) U46.EP(EP.VSS_EP) U46.V1(EP.VSS_EP) U46.V2(EP.VSS_EP) U46.V3(EP.VSS_EP) U46.V4(EP.VSS_EP) U46.V5(EP.VSS_EP) U46.V6(EP.VSS_EP) U46.V7(EP.VSS_EP) U46.V8(EP.VSS_EP) U46.V9(EP.VSS_EP) U46.V10(EP.VSS_EP) U46.V11(EP.VSS_EP) U46.V12(EP.VSS_EP) U46.V13(EP.VSS_EP) U46.V14(EP.VSS_EP) U46.V15(EP.VSS_EP) U46.V16(EP.VSS_EP) U46.V17(EP.VSS_EP) U46.V18(EP.VSS_EP) U46.V19(EP.VSS_EP) U46.V20(EP.VSS_EP) U46.V21(EP.VSS_EP) U46.V22(EP.VSS_EP) U46.V23(EP.VSS_EP) U46.V24(EP.VSS_EP) U46.V25(EP.VSS_EP) U47.1(1.QCM) U47.2(2.CMPLUS) U47.3(3.CMMINUS) U47.EP(EP.VSS_EP) U47.V1(EP.VSS_EP) U47.V2(EP.VSS_EP) U47.V3(EP.VSS_EP) U47.V4(EP.VSS_EP) U47.V5(EP.VSS_EP) U47.V6(EP.VSS_EP) U47.V7(EP.VSS_EP) U47.V8(EP.VSS_EP) U47.V9(EP.VSS_EP) U47.V10(EP.VSS_EP) U47.V11(EP.VSS_EP) U47.V12(EP.VSS_EP) U47.V13(EP.VSS_EP) U47.V14(EP.VSS_EP) U47.V15(EP.VSS_EP) U47.V16(EP.VSS_EP) U47.V17(EP.VSS_EP) U47.V18(EP.VSS_EP) U47.V19(EP.VSS_EP) U47.V20(EP.VSS_EP) U47.V21(EP.VSS_EP) U47.V22(EP.VSS_EP) U47.V23(EP.VSS_EP) U47.V24(EP.VSS_EP) U47.V25(EP.VSS_EP) U48.1(1.QCM) U48.2(2.CMPLUS) U48.3(3.CMMINUS) U48.EP(EP.VSS_EP) U48.V1(EP.VSS_EP) U48.V2(EP.VSS_EP) U48.V3(EP.VSS_EP) U48.V4(EP.VSS_EP) U48.V5(EP.VSS_EP) U48.V6(EP.VSS_EP) U48.V7(EP.VSS_EP) U48.V8(EP.VSS_EP) U48.V9(EP.VSS_EP) U48.V10(EP.VSS_EP) U48.V11(EP.VSS_EP) U48.V12(EP.VSS_EP) U48.V13(EP.VSS_EP) U48.V14(EP.VSS_EP) U48.V15(EP.VSS_EP) U48.V16(EP.VSS_EP) U48.V17(EP.VSS_EP) U48.V18(EP.VSS_EP) U48.V19(EP.VSS_EP) U48.V20(EP.VSS_EP) U48.V21(EP.VSS_EP) U48.V22(EP.VSS_EP) U48.V23(EP.VSS_EP) U48.V24(EP.VSS_EP) U48.V25(EP.VSS_EP) U49.1(1.QCM) U49.2(2.CMPLUS) U49.3(3.CMMINUS) U49.EP(EP.VSS_EP) U49.V1(EP.VSS_EP) U49.V2(EP.VSS_EP) U49.V3(EP.VSS_EP) U49.V4(EP.VSS_EP) U49.V5(EP.VSS_EP) U49.V6(EP.VSS_EP) U49.V7(EP.VSS_EP) U49.V8(EP.VSS_EP) U49.V9(EP.VSS_EP) U49.V10(EP.VSS_EP) U49.V11(EP.VSS_EP) U49.V12(EP.VSS_EP) U49.V13(EP.VSS_EP) U49.V14(EP.VSS_EP) U49.V15(EP.VSS_EP) U49.V16(EP.VSS_EP) U49.V17(EP.VSS_EP) U49.V18(EP.VSS_EP) U49.V19(EP.VSS_EP) U49.V20(EP.VSS_EP) U49.V21(EP.VSS_EP) U49.V22(EP.VSS_EP) U49.V23(EP.VSS_EP) U49.V24(EP.VSS_EP) U49.V25(EP.VSS_EP) ; also sheet 1,3
INCLK: SJ49.1 U40.12(12.INCLK) ; also sheet 1
INMISO: SJ3.1 U40.9(9.INMISO) ; also sheet 1
INMOSI: SJ2.1 U40.10(10.INMOSI) ; also sheet 1
INSCK: SJ1.1 U40.11(11.INSCK) ; also sheet 1
MISO0: SJ3.2 SJ6.1 U40.8(8.OUTMISO) U41.9(9.INMISO)
MISO1: SJ6.2 SJ9.1 U41.8(8.OUTMISO) U42.9(9.INMISO)
MISO2: SJ9.2 SJ12.1 U42.8(8.OUTMISO) U43.9(9.INMISO)
MISO3: SJ12.2 SJ15.1 U43.8(8.OUTMISO) U44.9(9.INMISO)
MISO4: SJ15.2 SJ18.1 U44.8(8.OUTMISO) U45.9(9.INMISO)
MISO5: SJ18.2 SJ21.1 U45.8(8.OUTMISO) U46.9(9.INMISO)
MISO6: SJ21.2 SJ24.1 U46.8(8.OUTMISO) U47.9(9.INMISO)
MISO7: SJ24.2 SJ39.1 U47.8(8.OUTMISO) U48.9(9.INMISO)
MISO8: SJ39.2 SJ42.1 U48.8(8.OUTMISO) U49.9(9.INMISO)
MISO9: SJ42.2 SJ45.1 U4A.9(9.INMISO) U49.8(8.OUTMISO)
MISO10: SJ45.2 SJ48.1 U4A.8(8.OUTMISO) U4B.9(9.INMISO)
MISO11: SJ27.1 SJ48.2 U4B.8(8.OUTMISO) U4C.9(9.INMISO)
MISO12: SJ27.2 SJ30.1 U4C.8(8.OUTMISO) U4D.9(9.INMISO)
MISO13: SJ30.2 SJ33.1 U4D.8(8.OUTMISO) U4E.9(9.INMISO)
MISO14: SJ33.2 SJ36.1 U4E.8(8.OUTMISO) U4F.9(9.INMISO)
MOSI0: SJ2.2 SJ5.1 U40.7(7.OUTMOSI) U41.10(10.INMOSI)
MOSI1: SJ5.2 SJ8.1 U41.7(7.OUTMOSI) U42.10(10.INMOSI)
MOSI2: SJ8.2 SJ11.1 U42.7(7.OUTMOSI) U43.10(10.INMOSI)
MOSI3: SJ11.2 SJ14.1 U43.7(7.OUTMOSI) U44.10(10.INMOSI)
MOSI4: SJ14.2 SJ17.1 U44.7(7.OUTMOSI) U45.10(10.INMOSI)
MOSI5: SJ17.2 SJ20.1 U45.7(7.OUTMOSI) U46.10(10.INMOSI)
MOSI6: SJ20.2 SJ23.1 U46.7(7.OUTMOSI) U47.10(10.INMOSI)
MOSI7: SJ23.2 SJ38.1 U47.7(7.OUTMOSI) U48.10(10.INMOSI)
MOSI8: SJ38.2 SJ41.1 U48.7(7.OUTMOSI) U49.10(10.INMOSI)
MOSI9: SJ41.2 SJ44.1 U4A.10(10.INMOSI) U49.7(7.OUTMOSI)
MOSI10: SJ44.2 SJ47.1 U4A.7(7.OUTMOSI) U4B.10(10.INMOSI)
MOSI11: SJ26.1 SJ47.2 U4B.7(7.OUTMOSI) U4C.10(10.INMOSI)
MOSI12: SJ26.2 SJ29.1 U4C.7(7.OUTMOSI) U4D.10(10.INMOSI)
MOSI13: SJ29.2 SJ32.1 U4D.7(7.OUTMOSI) U4E.10(10.INMOSI)
MOSI14: SJ32.2 SJ35.1 U4E.7(7.OUTMOSI) U4F.10(10.INMOSI)
OUTCLK: SJ64.2 U4F.5(5.OUTCLK) ; also sheet 1
OUTMISO: SJ36.2 U4F.8(8.OUTMISO) ; also sheet 1
OUTMOSI: SJ35.2 U4F.7(7.OUTMOSI) ; also sheet 1
OUTSCK: SJ34.2 U4F.6(6.OUTSCK) ; also sheet 1
SCK0: SJ1.2 SJ4.1 U40.6(6.OUTSCK) U41.11(11.INSCK)
SCK1: SJ4.2 SJ7.1 U41.6(6.OUTSCK) U42.11(11.INSCK)
SCK2: SJ7.2 SJ10.1 U42.6(6.OUTSCK) U43.11(11.INSCK)
SCK3: SJ10.2 SJ13.1 U43.6(6.OUTSCK) U44.11(11.INSCK)
SCK4: SJ13.2 SJ16.1 U44.6(6.OUTSCK) U45.11(11.INSCK)
SCK5: SJ16.2 SJ19.1 U45.6(6.OUTSCK) U46.11(11.INSCK)
SCK6: SJ19.2 SJ22.1 U46.6(6.OUTSCK) U47.11(11.INSCK)
SCK7: SJ22.2 SJ37.1 U47.6(6.OUTSCK) U48.11(11.INSCK)
SCK8: SJ37.2 SJ40.1 U48.6(6.OUTSCK) U49.11(11.INSCK)
SCK9: SJ40.2 SJ43.1 U4A.11(11.INSCK) U49.6(6.OUTSCK)
SCK10: SJ43.2 SJ46.1 U4A.6(6.OUTSCK) U4B.11(11.INSCK)
SCK11: SJ25.1 SJ46.2 U4B.6(6.OUTSCK) U4C.11(11.INSCK)
SCK12: SJ25.2 SJ28.1 U4C.6(6.OUTSCK) U4D.11(11.INSCK)
SCK13: SJ28.2 SJ31.1 U4D.6(6.OUTSCK) U4E.11(11.INSCK)
SCK14: SJ31.2 SJ34.1 U4E.6(6.OUTSCK) U4F.11(11.INSCK)
VDD_0V9: U4A.13(13.IOREF) U4A.14(14.VDD) U4A.15(15.VDD) U4A.16(16.VDD) U4A.17(17.VDD) U4A.18(18.VDD) U4A.19(19.VDD) U4A.20(20.VDD) U4A.21(21.VDD) U4A.22(22.VDD) U4A.23(23.VDD) U4A.24(24.VDD) U4A.25(25.VDD) U4A.26(26.VDD) U4A.27(27.VDD) U4A.28(28.VDD) U4A.29(29.VDD) U4A.30(30.VDD) U4A.31(31.VDD) U4A.32(32.VDD) U4A.33(33.VDD) U4A.34(34.VDD) U4A.35(35.VDD) U4A.36(36.VDD) U4A.37(37.VDD) U4A.38(38.VDD) U4A.39(39.VDD) U4A.40(40.VDD) U4A.41(41.VDD) U4A.42(42.VDD) U4A.43(43.VDD) U4A.44(44.VDD) U4A.45(45.VDD) U4A.46(46.VDD) U4A.47(47.VDD) U4A.48(48.VDD) U4B.13(13.IOREF) U4B.14(14.VDD) U4B.15(15.VDD) U4B.16(16.VDD) U4B.17(17.VDD) U4B.18(18.VDD) U4B.19(19.VDD) U4B.20(20.VDD) U4B.21(21.VDD) U4B.22(22.VDD) U4B.23(23.VDD) U4B.24(24.VDD) U4B.25(25.VDD) U4B.26(26.VDD) U4B.27(27.VDD) U4B.28(28.VDD) U4B.29(29.VDD) U4B.30(30.VDD) U4B.31(31.VDD) U4B.32(32.VDD) U4B.33(33.VDD) U4B.34(34.VDD) U4B.35(35.VDD) U4B.36(36.VDD) U4B.37(37.VDD) U4B.38(38.VDD) U4B.39(39.VDD) U4B.40(40.VDD) U4B.41(41.VDD) U4B.42(42.VDD) U4B.43(43.VDD) U4B.44(44.VDD) U4B.45(45.VDD) U4B.46(46.VDD) U4B.47(47.VDD) U4B.48(48.VDD) U4C.13(13.IOREF) U4C.14(14.VDD) U4C.15(15.VDD) U4C.16(16.VDD) U4C.17(17.VDD) U4C.18(18.VDD) U4C.19(19.VDD) U4C.20(20.VDD) U4C.21(21.VDD) U4C.22(22.VDD) U4C.23(23.VDD) U4C.24(24.VDD) U4C.25(25.VDD) U4C.26(26.VDD) U4C.27(27.VDD) U4C.28(28.VDD) U4C.29(29.VDD) U4C.30(30.VDD) U4C.31(31.VDD) U4C.32(32.VDD) U4C.33(33.VDD) U4C.34(34.VDD) U4C.35(35.VDD) U4C.36(36.VDD) U4C.37(37.VDD) U4C.38(38.VDD) U4C.39(39.VDD) U4C.40(40.VDD) U4C.41(41.VDD) U4C.42(42.VDD) U4C.43(43.VDD) U4C.44(44.VDD) U4C.45(45.VDD) U4C.46(46.VDD) U4C.47(47.VDD) U4C.48(48.VDD) U4D.13(13.IOREF) U4D.14(14.VDD) U4D.15(15.VDD) U4D.16(16.VDD) U4D.17(17.VDD) U4D.18(18.VDD) U4D.19(19.VDD) U4D.20(20.VDD) U4D.21(21.VDD) U4D.22(22.VDD) U4D.23(23.VDD) U4D.24(24.VDD) U4D.25(25.VDD) U4D.26(26.VDD) U4D.27(27.VDD) U4D.28(28.VDD) U4D.29(29.VDD) U4D.30(30.VDD) U4D.31(31.VDD) U4D.32(32.VDD) U4D.33(33.VDD) U4D.34(34.VDD) U4D.35(35.VDD) U4D.36(36.VDD) U4D.37(37.VDD) U4D.38(38.VDD) U4D.39(39.VDD) U4D.40(40.VDD) U4D.41(41.VDD) U4D.42(42.VDD) U4D.43(43.VDD) U4D.44(44.VDD) U4D.45(45.VDD) U4D.46(46.VDD) U4D.47(47.VDD) U4D.48(48.VDD) U4E.13(13.IOREF) U4E.14(14.VDD) U4E.15(15.VDD) U4E.16(16.VDD) U4E.17(17.VDD) U4E.18(18.VDD) U4E.19(19.VDD) U4E.20(20.VDD) U4E.21(21.VDD) U4E.22(22.VDD) U4E.23(23.VDD) U4E.24(24.VDD) U4E.25(25.VDD) U4E.26(26.VDD) U4E.27(27.VDD) U4E.28(28.VDD) U4E.29(29.VDD) U4E.30(30.VDD) U4E.31(31.VDD) U4E.32(32.VDD) U4E.33(33.VDD) U4E.34(34.VDD) U4E.35(35.VDD) U4E.36(36.VDD) U4E.37(37.VDD) U4E.38(38.VDD) U4E.39(39.VDD) U4E.40(40.VDD) U4E.41(41.VDD) U4E.42(42.VDD) U4E.43(43.VDD) U4E.44(44.VDD) U4E.45(45.VDD) U4E.46(46.VDD) U4E.47(47.VDD) U4E.48(48.VDD) U4F.13(13.IOREF) U4F.14(14.VDD) U4F.15(15.VDD) U4F.16(16.VDD) U4F.17(17.VDD) U4F.18(18.VDD) U4F.19(19.VDD) U4F.20(20.VDD) U4F.21(21.VDD) U4F.22(22.VDD) U4F.23(23.VDD) U4F.24(24.VDD) U4F.25(25.VDD) U4F.26(26.VDD) U4F.27(27.VDD) U4F.28(28.VDD) U4F.29(29.VDD) U4F.30(30.VDD) U4F.31(31.VDD) U4F.32(32.VDD) U4F.33(33.VDD) U4F.34(34.VDD) U4F.35(35.VDD) U4F.36(36.VDD) U4F.37(37.VDD) U4F.38(38.VDD) U4F.39(39.VDD) U4F.40(40.VDD) U4F.41(41.VDD) U4F.42(42.VDD) U4F.43(43.VDD) U4F.44(44.VDD) U4F.45(45.VDD) U4F.46(46.VDD) U4F.47(47.VDD) U4F.48(48.VDD) U40.13(13.IOREF) U40.14(14.VDD) U40.15(15.VDD) U40.16(16.VDD) U40.17(17.VDD) U40.18(18.VDD) U40.19(19.VDD) U40.20(20.VDD) U40.21(21.VDD) U40.22(22.VDD) U40.23(23.VDD) U40.24(24.VDD) U40.25(25.VDD) U40.26(26.VDD) U40.27(27.VDD) U40.28(28.VDD) U40.29(29.VDD) U40.30(30.VDD) U40.31(31.VDD) U40.32(32.VDD) U40.33(33.VDD) U40.34(34.VDD) U40.35(35.VDD) U40.36(36.VDD) U40.37(37.VDD) U40.38(38.VDD) U40.39(39.VDD) U40.40(40.VDD) U40.41(41.VDD) U40.42(42.VDD) U40.43(43.VDD) U40.44(44.VDD) U40.45(45.VDD) U40.46(46.VDD) U40.47(47.VDD) U40.48(48.VDD) U41.13(13.IOREF) U41.14(14.VDD) U41.15(15.VDD) U41.16(16.VDD) U41.17(17.VDD) U41.18(18.VDD) U41.19(19.VDD) U41.20(20.VDD) U41.21(21.VDD) U41.22(22.VDD) U41.23(23.VDD) U41.24(24.VDD) U41.25(25.VDD) U41.26(26.VDD) U41.27(27.VDD) U41.28(28.VDD) U41.29(29.VDD) U41.30(30.VDD) U41.31(31.VDD) U41.32(32.VDD) U41.33(33.VDD) U41.34(34.VDD) U41.35(35.VDD) U41.36(36.VDD) U41.37(37.VDD) U41.38(38.VDD) U41.39(39.VDD) U41.40(40.VDD) U41.41(41.VDD) U41.42(42.VDD) U41.43(43.VDD) U41.44(44.VDD) U41.45(45.VDD) U41.46(46.VDD) U41.47(47.VDD) U41.48(48.VDD) U42.13(13.IOREF) U42.14(14.VDD) U42.15(15.VDD) U42.16(16.VDD) U42.17(17.VDD) U42.18(18.VDD) U42.19(19.VDD) U42.20(20.VDD) U42.21(21.VDD) U42.22(22.VDD) U42.23(23.VDD) U42.24(24.VDD) U42.25(25.VDD) U42.26(26.VDD) U42.27(27.VDD) U42.28(28.VDD) U42.29(29.VDD) U42.30(30.VDD) U42.31(31.VDD) U42.32(32.VDD) U42.33(33.VDD) U42.34(34.VDD) U42.35(35.VDD) U42.36(36.VDD) U42.37(37.VDD) U42.38(38.VDD) U42.39(39.VDD) U42.40(40.VDD) U42.41(41.VDD) U42.42(42.VDD) U42.43(43.VDD) U42.44(44.VDD) U42.45(45.VDD) U42.46(46.VDD) U42.47(47.VDD) U42.48(48.VDD) U43.13(13.IOREF) U43.14(14.VDD) U43.15(15.VDD) U43.16(16.VDD) U43.17(17.VDD) U43.18(18.VDD) U43.19(19.VDD) U43.20(20.VDD) U43.21(21.VDD) U43.22(22.VDD) U43.23(23.VDD) U43.24(24.VDD) U43.25(25.VDD) U43.26(26.VDD) U43.27(27.VDD) U43.28(28.VDD) U43.29(29.VDD) U43.30(30.VDD) U43.31(31.VDD) U43.32(32.VDD) U43.33(33.VDD) U43.34(34.VDD) U43.35(35.VDD) U43.36(36.VDD) U43.37(37.VDD) U43.38(38.VDD) U43.39(39.VDD) U43.40(40.VDD) U43.41(41.VDD) U43.42(42.VDD) U43.43(43.VDD) U43.44(44.VDD) U43.45(45.VDD) U43.46(46.VDD) U43.47(47.VDD) U43.48(48.VDD) U44.13(13.IOREF) U44.14(14.VDD) U44.15(15.VDD) U44.16(16.VDD) U44.17(17.VDD) U44.18(18.VDD) U44.19(19.VDD) U44.20(20.VDD) U44.21(21.VDD) U44.22(22.VDD) U44.23(23.VDD) U44.24(24.VDD) U44.25(25.VDD) U44.26(26.VDD) U44.27(27.VDD) U44.28(28.VDD) U44.29(29.VDD) U44.30(30.VDD) U44.31(31.VDD) U44.32(32.VDD) U44.33(33.VDD) U44.34(34.VDD) U44.35(35.VDD) U44.36(36.VDD) U44.37(37.VDD) U44.38(38.VDD) U44.39(39.VDD) U44.40(40.VDD) U44.41(41.VDD) U44.42(42.VDD) U44.43(43.VDD) U44.44(44.VDD) U44.45(45.VDD) U44.46(46.VDD) U44.47(47.VDD) U44.48(48.VDD) U45.13(13.IOREF) U45.14(14.VDD) U45.15(15.VDD) U45.16(16.VDD) U45.17(17.VDD) U45.18(18.VDD) U45.19(19.VDD) U45.20(20.VDD) U45.21(21.VDD) U45.22(22.VDD) U45.23(23.VDD) U45.24(24.VDD) U45.25(25.VDD) U45.26(26.VDD) U45.27(27.VDD) U45.28(28.VDD) U45.29(29.VDD) U45.30(30.VDD) U45.31(31.VDD) U45.32(32.VDD) U45.33(33.VDD) U45.34(34.VDD) U45.35(35.VDD) U45.36(36.VDD) U45.37(37.VDD) U45.38(38.VDD) U45.39(39.VDD) U45.40(40.VDD) U45.41(41.VDD) U45.42(42.VDD) U45.43(43.VDD) U45.44(44.VDD) U45.45(45.VDD) U45.46(46.VDD) U45.47(47.VDD) U45.48(48.VDD) U46.13(13.IOREF) U46.14(14.VDD) U46.15(15.VDD) U46.16(16.VDD) U46.17(17.VDD) U46.18(18.VDD) U46.19(19.VDD) U46.20(20.VDD) U46.21(21.VDD) U46.22(22.VDD) U46.23(23.VDD) U46.24(24.VDD) U46.25(25.VDD) U46.26(26.VDD) U46.27(27.VDD) U46.28(28.VDD) U46.29(29.VDD) U46.30(30.VDD) U46.31(31.VDD) U46.32(32.VDD) U46.33(33.VDD) U46.34(34.VDD) U46.35(35.VDD) U46.36(36.VDD) U46.37(37.VDD) U46.38(38.VDD) U46.39(39.VDD) U46.40(40.VDD) U46.41(41.VDD) U46.42(42.VDD) U46.43(43.VDD) U46.44(44.VDD) U46.45(45.VDD) U46.46(46.VDD) U46.47(47.VDD) U46.48(48.VDD) U47.13(13.IOREF) U47.14(14.VDD) U47.15(15.VDD) U47.16(16.VDD) U47.17(17.VDD) U47.18(18.VDD) U47.19(19.VDD) U47.20(20.VDD) U47.21(21.VDD) U47.22(22.VDD) U47.23(23.VDD) U47.24(24.VDD) U47.25(25.VDD) U47.26(26.VDD) U47.27(27.VDD) U47.28(28.VDD) U47.29(29.VDD) U47.30(30.VDD) U47.31(31.VDD) U47.32(32.VDD) U47.33(33.VDD) U47.34(34.VDD) U47.35(35.VDD) U47.36(36.VDD) U47.37(37.VDD) U47.38(38.VDD) U47.39(39.VDD) U47.40(40.VDD) U47.41(41.VDD) U47.42(42.VDD) U47.43(43.VDD) U47.44(44.VDD) U47.45(45.VDD) U47.46(46.VDD) U47.47(47.VDD) U47.48(48.VDD) U48.13(13.IOREF) U48.14(14.VDD) U48.15(15.VDD) U48.16(16.VDD) U48.17(17.VDD) U48.18(18.VDD) U48.19(19.VDD) U48.20(20.VDD) U48.21(21.VDD) U48.22(22.VDD) U48.23(23.VDD) U48.24(24.VDD) U48.25(25.VDD) U48.26(26.VDD) U48.27(27.VDD) U48.28(28.VDD) U48.29(29.VDD) U48.30(30.VDD) U48.31(31.VDD) U48.32(32.VDD) U48.33(33.VDD) U48.34(34.VDD) U48.35(35.VDD) U48.36(36.VDD) U48.37(37.VDD) U48.38(38.VDD) U48.39(39.VDD) U48.40(40.VDD) U48.41(41.VDD) U48.42(42.VDD) U48.43(43.VDD) U48.44(44.VDD) U48.45(45.VDD) U48.46(46.VDD) U48.47(47.VDD) U48.48(48.VDD) U49.13(13.IOREF) U49.14(14.VDD) U49.15(15.VDD) U49.16(16.VDD) U49.17(17.VDD) U49.18(18.VDD) U49.19(19.VDD) U49.20(20.VDD) U49.21(21.VDD) U49.22(22.VDD) U49.23(23.VDD) U49.24(24.VDD) U49.25(25.VDD) U49.26(26.VDD) U49.27(27.VDD) U49.28(28.VDD) U49.29(29.VDD) U49.30(30.VDD) U49.31(31.VDD) U49.32(32.VDD) U49.33(33.VDD) U49.34(34.VDD) U49.35(35.VDD) U49.36(36.VDD) U49.37(37.VDD) U49.38(38.VDD) U49.39(39.VDD) U49.40(40.VDD) U49.41(41.VDD) U49.42(42.VDD) U49.43(43.VDD) U49.44(44.VDD) U49.45(45.VDD) U49.46(46.VDD) U49.47(47.VDD) U49.48(48.VDD) ; supply symbol labelled VCC_0V9 ; also sheet 1,3
VDD_1V8: U4A.4(4.VDD_IO) U4B.4(4.VDD_IO) U4C.4(4.VDD_IO) U4D.4(4.VDD_IO) U4E.4(4.VDD_IO) U4F.4(4.VDD_IO) U40.4(4.VDD_IO) U41.4(4.VDD_IO) U42.4(4.VDD_IO) U43.4(4.VDD_IO) U44.4(4.VDD_IO) U45.4(4.VDD_IO) U46.4(4.VDD_IO) U47.4(4.VDD_IO) U48.4(4.VDD_IO) U49.4(4.VDD_IO) ; supply symbol labelled VCC_1V8 ; also sheet 1

### Notes on the sheet
- * PINNING | : OK
- * FUNCTIONALITY | : NO - todo: ICLK-OCLOCK
- * PHYSICAL SIZE | : OK
- * IN HOUSE | : OK
- * LAID OUT | : OK
- * COMPS IN LIB | : OK

## Sheet 3 of 3
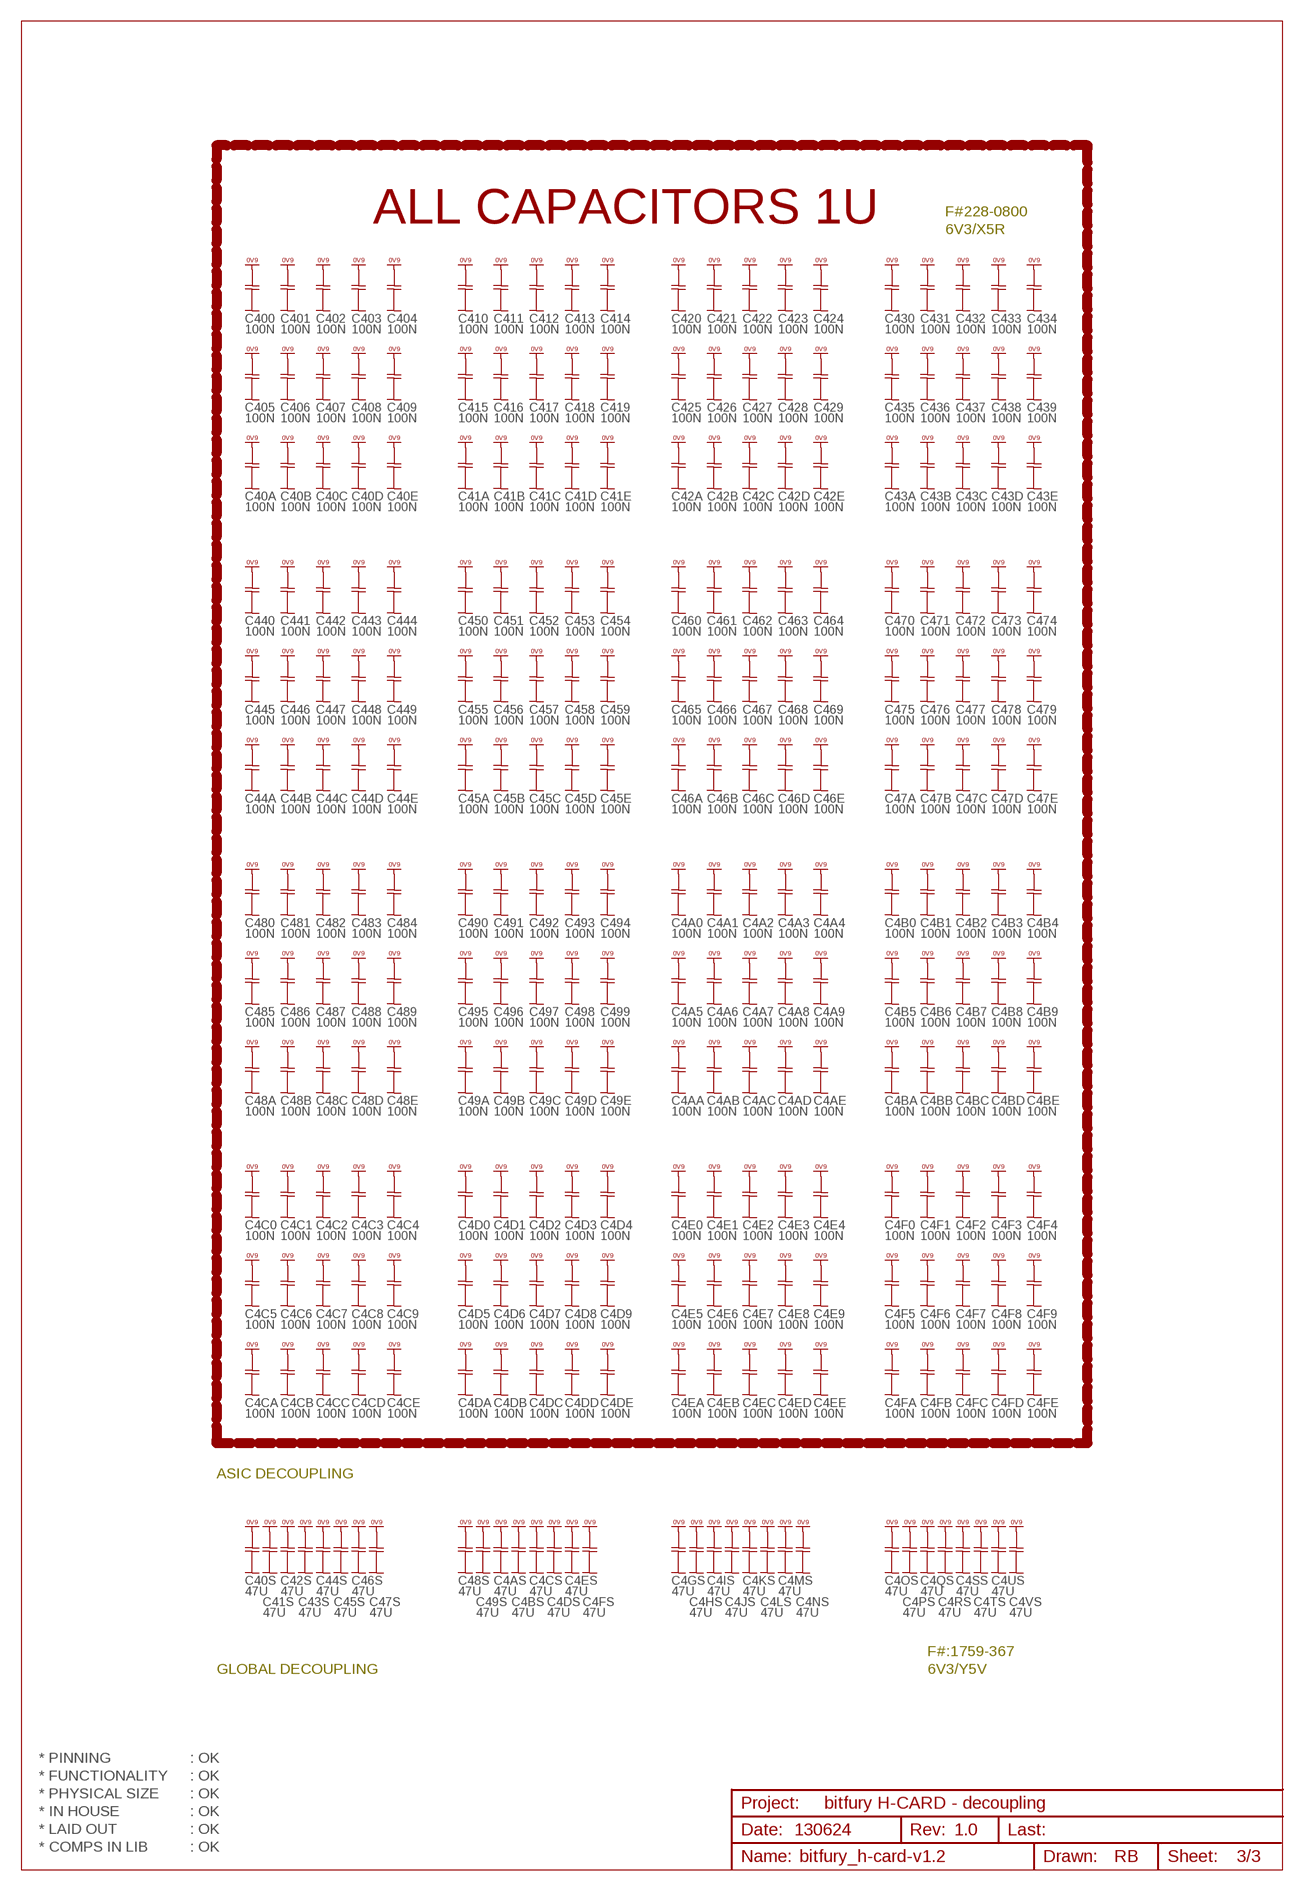
[diagram p3: schematic, sheet 3]

### Parts
C4A0  100N  CAP0402  [CAP0402]
C4A1  100N  CAP0402  [CAP0402]
C4A2  100N  CAP0402  [CAP0402]
C4A3  100N  CAP0402  [CAP0402]
C4A4  100N  CAP0402  [CAP0402]
C4A5  100N  CAP0402  [CAP0402]
C4A6  100N  CAP0402  [CAP0402]
C4A7  100N  CAP0402  [CAP0402]
C4A8  100N  CAP0402  [CAP0402]
C4A9  100N  CAP0402  [CAP0402]
C4AA  100N  CAP0402  [CAP0402]
C4AB  100N  CAP0402  [CAP0402]
C4AC  100N  CAP0402  [CAP0402]
C4AD  100N  CAP0402  [CAP0402]
C4AE  100N  CAP0402  [CAP0402]
C4AS  47U  CAP1210  [CAP1210]
C4B0  100N  CAP0402  [CAP0402]
C4B1  100N  CAP0402  [CAP0402]
C4B2  100N  CAP0402  [CAP0402]
C4B3  100N  CAP0402  [CAP0402]
C4B4  100N  CAP0402  [CAP0402]
C4B5  100N  CAP0402  [CAP0402]
C4B6  100N  CAP0402  [CAP0402]
C4B7  100N  CAP0402  [CAP0402]
C4B8  100N  CAP0402  [CAP0402]
C4B9  100N  CAP0402  [CAP0402]
C4BA  100N  CAP0402  [CAP0402]
C4BB  100N  CAP0402  [CAP0402]
C4BC  100N  CAP0402  [CAP0402]
C4BD  100N  CAP0402  [CAP0402]
C4BE  100N  CAP0402  [CAP0402]
C4BS  47U  CAP1210  [CAP1210]
C4C0  100N  CAP0402  [CAP0402]
C4C1  100N  CAP0402  [CAP0402]
C4C2  100N  CAP0402  [CAP0402]
C4C3  100N  CAP0402  [CAP0402]
C4C4  100N  CAP0402  [CAP0402]
C4C5  100N  CAP0402  [CAP0402]
C4C6  100N  CAP0402  [CAP0402]
C4C7  100N  CAP0402  [CAP0402]
C4C8  100N  CAP0402  [CAP0402]
C4C9  100N  CAP0402  [CAP0402]
C4CA  100N  CAP0402  [CAP0402]
C4CB  100N  CAP0402  [CAP0402]
C4CC  100N  CAP0402  [CAP0402]
C4CD  100N  CAP0402  [CAP0402]
C4CE  100N  CAP0402  [CAP0402]
C4CS  47U  CAP1210  [CAP1210]
C4D0  100N  CAP0402  [CAP0402]
C4D1  100N  CAP0402  [CAP0402]
C4D2  100N  CAP0402  [CAP0402]
C4D3  100N  CAP0402  [CAP0402]
C4D4  100N  CAP0402  [CAP0402]
C4D5  100N  CAP0402  [CAP0402]
C4D6  100N  CAP0402  [CAP0402]
C4D7  100N  CAP0402  [CAP0402]
C4D8  100N  CAP0402  [CAP0402]
C4D9  100N  CAP0402  [CAP0402]
C4DA  100N  CAP0402  [CAP0402]
C4DB  100N  CAP0402  [CAP0402]
C4DC  100N  CAP0402  [CAP0402]
C4DD  100N  CAP0402  [CAP0402]
C4DE  100N  CAP0402  [CAP0402]
C4DS  47U  CAP1210  [CAP1210]
C4E0  100N  CAP0402  [CAP0402]
C4E1  100N  CAP0402  [CAP0402]
C4E2  100N  CAP0402  [CAP0402]
C4E3  100N  CAP0402  [CAP0402]
C4E4  100N  CAP0402  [CAP0402]
C4E5  100N  CAP0402  [CAP0402]
C4E6  100N  CAP0402  [CAP0402]
C4E7  100N  CAP0402  [CAP0402]
C4E8  100N  CAP0402  [CAP0402]
C4E9  100N  CAP0402  [CAP0402]
C4EA  100N  CAP0402  [CAP0402]
C4EB  100N  CAP0402  [CAP0402]
C4EC  100N  CAP0402  [CAP0402]
C4ED  100N  CAP0402  [CAP0402]
C4EE  100N  CAP0402  [CAP0402]
C4ES  47U  CAP1210  [CAP1210]
C4F0  100N  CAP0402  [CAP0402]
C4F1  100N  CAP0402  [CAP0402]
C4F2  100N  CAP0402  [CAP0402]
C4F3  100N  CAP0402  [CAP0402]
C4F4  100N  CAP0402  [CAP0402]
C4F5  100N  CAP0402  [CAP0402]
C4F6  100N  CAP0402  [CAP0402]
C4F7  100N  CAP0402  [CAP0402]
C4F8  100N  CAP0402  [CAP0402]
C4F9  100N  CAP0402  [CAP0402]
C4FA  100N  CAP0402  [CAP0402]
C4FB  100N  CAP0402  [CAP0402]
C4FC  100N  CAP0402  [CAP0402]
C4FD  100N  CAP0402  [CAP0402]
C4FE  100N  CAP0402  [CAP0402]
C4FS  47U  CAP1210  [CAP1210]
C4GS  47U  CAP1210  [CAP1210]
C4HS  47U  CAP1210  [CAP1210]
C4IS  47U  CAP1210  [CAP1210]
C4JS  47U  CAP1210  [CAP1210]
C4KS  47U  CAP1210  [CAP1210]
C4LS  47U  CAP1210  [CAP1210]
C4MS  47U  CAP1210  [CAP1210]
C4NS  47U  CAP1210  [CAP1210]
C4OS  47U  CAP1210  [CAP1210]
C4PS  47U  CAP1210  [CAP1210]
C4QS  47U  CAP1210  [CAP1210]
C4RS  47U  CAP1210  [CAP1210]
C4SS  47U  CAP1210  [CAP1210]
C4TS  47U  CAP1210  [CAP1210]
C4US  47U  CAP1210  [CAP1210]
C4VS  47U  CAP1210  [CAP1210]
C40A  100N  CAP0402  [CAP0402]
C40B  100N  CAP0402  [CAP0402]
C40C  100N  CAP0402  [CAP0402]
C40D  100N  CAP0402  [CAP0402]
C40E  100N  CAP0402  [CAP0402]
C40S  47U  CAP1210  [CAP1210]
C41A  100N  CAP0402  [CAP0402]
C41B  100N  CAP0402  [CAP0402]
C41C  100N  CAP0402  [CAP0402]
C41D  100N  CAP0402  [CAP0402]
C41E  100N  CAP0402  [CAP0402]
C41S  47U  CAP1210  [CAP1210]
C42A  100N  CAP0402  [CAP0402]
C42B  100N  CAP0402  [CAP0402]
C42C  100N  CAP0402  [CAP0402]
C42D  100N  CAP0402  [CAP0402]
C42E  100N  CAP0402  [CAP0402]
C42S  47U  CAP1210  [CAP1210]
C43A  100N  CAP0402  [CAP0402]
C43B  100N  CAP0402  [CAP0402]
C43C  100N  CAP0402  [CAP0402]
C43D  100N  CAP0402  [CAP0402]
C43E  100N  CAP0402  [CAP0402]
C43S  47U  CAP1210  [CAP1210]
C44A  100N  CAP0402  [CAP0402]
C44B  100N  CAP0402  [CAP0402]
C44C  100N  CAP0402  [CAP0402]
C44D  100N  CAP0402  [CAP0402]
C44E  100N  CAP0402  [CAP0402]
C44S  47U  CAP1210  [CAP1210]
C45A  100N  CAP0402  [CAP0402]
C45B  100N  CAP0402  [CAP0402]
C45C  100N  CAP0402  [CAP0402]
C45D  100N  CAP0402  [CAP0402]
C45E  100N  CAP0402  [CAP0402]
C45S  47U  CAP1210  [CAP1210]
C46A  100N  CAP0402  [CAP0402]
C46B  100N  CAP0402  [CAP0402]
C46C  100N  CAP0402  [CAP0402]
C46D  100N  CAP0402  [CAP0402]
C46E  100N  CAP0402  [CAP0402]
C46S  47U  CAP1210  [CAP1210]
C47A  100N  CAP0402  [CAP0402]
C47B  100N  CAP0402  [CAP0402]
C47C  100N  CAP0402  [CAP0402]
C47D  100N  CAP0402  [CAP0402]
C47E  100N  CAP0402  [CAP0402]
C47S  47U  CAP1210  [CAP1210]
C48A  100N  CAP0402  [CAP0402]
C48B  100N  CAP0402  [CAP0402]
C48C  100N  CAP0402  [CAP0402]
C48D  100N  CAP0402  [CAP0402]
C48E  100N  CAP0402  [CAP0402]
C48S  47U  CAP1210  [CAP1210]
C49A  100N  CAP0402  [CAP0402]
C49B  100N  CAP0402  [CAP0402]
C49C  100N  CAP0402  [CAP0402]
C49D  100N  CAP0402  [CAP0402]
C49E  100N  CAP0402  [CAP0402]
C49S  47U  CAP1210  [CAP1210]
C400  100N  CAP0402  [CAP0402]
C401  100N  CAP0402  [CAP0402]
C402  100N  CAP0402  [CAP0402]
C403  100N  CAP0402  [CAP0402]
C404  100N  CAP0402  [CAP0402]
C405  100N  CAP0402  [CAP0402]
C406  100N  CAP0402  [CAP0402]
C407  100N  CAP0402  [CAP0402]
C408  100N  CAP0402  [CAP0402]
C409  100N  CAP0402  [CAP0402]
C410  100N  CAP0402  [CAP0402]
C411  100N  CAP0402  [CAP0402]
C412  100N  CAP0402  [CAP0402]
C413  100N  CAP0402  [CAP0402]
C414  100N  CAP0402  [CAP0402]
C415  100N  CAP0402  [CAP0402]
C416  100N  CAP0402  [CAP0402]
C417  100N  CAP0402  [CAP0402]
C418  100N  CAP0402  [CAP0402]
C419  100N  CAP0402  [CAP0402]
C420  100N  CAP0402  [CAP0402]
C421  100N  CAP0402  [CAP0402]
C422  100N  CAP0402  [CAP0402]
C423  100N  CAP0402  [CAP0402]
C424  100N  CAP0402  [CAP0402]
C425  100N  CAP0402  [CAP0402]
C426  100N  CAP0402  [CAP0402]
C427  100N  CAP0402  [CAP0402]
C428  100N  CAP0402  [CAP0402]
C429  100N  CAP0402  [CAP0402]
C430  100N  CAP0402  [CAP0402]
C431  100N  CAP0402  [CAP0402]
C432  100N  CAP0402  [CAP0402]
C433  100N  CAP0402  [CAP0402]
C434  100N  CAP0402  [CAP0402]
C435  100N  CAP0402  [CAP0402]
C436  100N  CAP0402  [CAP0402]
C437  100N  CAP0402  [CAP0402]
C438  100N  CAP0402  [CAP0402]
C439  100N  CAP0402  [CAP0402]
C440  100N  CAP0402  [CAP0402]
C441  100N  CAP0402  [CAP0402]
C442  100N  CAP0402  [CAP0402]
C443  100N  CAP0402  [CAP0402]
C444  100N  CAP0402  [CAP0402]
C445  100N  CAP0402  [CAP0402]
C446  100N  CAP0402  [CAP0402]
C447  100N  CAP0402  [CAP0402]
C448  100N  CAP0402  [CAP0402]
C449  100N  CAP0402  [CAP0402]
C450  100N  CAP0402  [CAP0402]
C451  100N  CAP0402  [CAP0402]
C452  100N  CAP0402  [CAP0402]
C453  100N  CAP0402  [CAP0402]
C454  100N  CAP0402  [CAP0402]
C455  100N  CAP0402  [CAP0402]
C456  100N  CAP0402  [CAP0402]
C457  100N  CAP0402  [CAP0402]
C458  100N  CAP0402  [CAP0402]
C459  100N  CAP0402  [CAP0402]
C460  100N  CAP0402  [CAP0402]
C461  100N  CAP0402  [CAP0402]
C462  100N  CAP0402  [CAP0402]
C463  100N  CAP0402  [CAP0402]
C464  100N  CAP0402  [CAP0402]
C465  100N  CAP0402  [CAP0402]
C466  100N  CAP0402  [CAP0402]
C467  100N  CAP0402  [CAP0402]
C468  100N  CAP0402  [CAP0402]
C469  100N  CAP0402  [CAP0402]
C470  100N  CAP0402  [CAP0402]
C471  100N  CAP0402  [CAP0402]
C472  100N  CAP0402  [CAP0402]
C473  100N  CAP0402  [CAP0402]
C474  100N  CAP0402  [CAP0402]
C475  100N  CAP0402  [CAP0402]
C476  100N  CAP0402  [CAP0402]
C477  100N  CAP0402  [CAP0402]
C478  100N  CAP0402  [CAP0402]
C479  100N  CAP0402  [CAP0402]
C480  100N  CAP0402  [CAP0402]
C481  100N  CAP0402  [CAP0402]
C482  100N  CAP0402  [CAP0402]
C483  100N  CAP0402  [CAP0402]
C484  100N  CAP0402  [CAP0402]
C485  100N  CAP0402  [CAP0402]
C486  100N  CAP0402  [CAP0402]
C487  100N  CAP0402  [CAP0402]
C488  100N  CAP0402  [CAP0402]
C489  100N  CAP0402  [CAP0402]
C490  100N  CAP0402  [CAP0402]
C491  100N  CAP0402  [CAP0402]
C492  100N  CAP0402  [CAP0402]
C493  100N  CAP0402  [CAP0402]
C494  100N  CAP0402  [CAP0402]
C495  100N  CAP0402  [CAP0402]
C496  100N  CAP0402  [CAP0402]
C497  100N  CAP0402  [CAP0402]
C498  100N  CAP0402  [CAP0402]
C499  100N  CAP0402  [CAP0402]

### Nets
GND: C4A0.2 C4A1.2 C4A2.2 C4A3.2 C4A4.2 C4A5.2 C4A6.2 C4A7.2 C4A8.2 C4A9.2 C4AA.2 C4AB.2 C4AC.2 C4AD.2 C4AE.2 C4AS.2 C4B0.2 C4B1.2 C4B2.2 C4B3.2 C4B4.2 C4B5.2 C4B6.2 C4B7.2 C4B8.2 C4B9.2 C4BA.2 C4BB.2 C4BC.2 C4BD.2 C4BE.2 C4BS.2 C4C0.2 C4C1.2 C4C2.2 C4C3.2 C4C4.2 C4C5.2 C4C6.2 C4C7.2 C4C8.2 C4C9.2 C4CA.2 C4CB.2 C4CC.2 C4CD.2 C4CE.2 C4CS.2 C4D0.2 C4D1.2 C4D2.2 C4D3.2 C4D4.2 C4D5.2 C4D6.2 C4D7.2 C4D8.2 C4D9.2 C4DA.2 C4DB.2 C4DC.2 C4DD.2 C4DE.2 C4DS.2 C4E0.2 C4E1.2 C4E2.2 C4E3.2 C4E4.2 C4E5.2 C4E6.2 C4E7.2 C4E8.2 C4E9.2 C4EA.2 C4EB.2 C4EC.2 C4ED.2 C4EE.2 C4ES.2 C4F0.2 C4F1.2 C4F2.2 C4F3.2 C4F4.2 C4F5.2 C4F6.2 C4F7.2 C4F8.2 C4F9.2 C4FA.2 C4FB.2 C4FC.2 C4FD.2 C4FE.2 C4FS.2 C4GS.2 C4HS.2 C4IS.2 C4JS.2 C4KS.2 C4LS.2 C4MS.2 C4NS.2 C4OS.2 C4PS.2 C4QS.2 C4RS.2 C4SS.2 C4TS.2 C4US.2 C4VS.2 C40A.2 C40B.2 C40C.2 C40D.2 C40E.2 C40S.2 C41A.2 C41B.2 C41C.2 C41D.2 C41E.2 C41S.2 C42A.2 C42B.2 C42C.2 C42D.2 C42E.2 C42S.2 C43A.2 C43B.2 C43C.2 C43D.2 C43E.2 C43S.2 C44A.2 C44B.2 C44C.2 C44D.2 C44E.2 C44S.2 C45A.2 C45B.2 C45C.2 C45D.2 C45E.2 C45S.2 C46A.2 C46B.2 C46C.2 C46D.2 C46E.2 C46S.2 C47A.2 C47B.2 C47C.2 C47D.2 C47E.2 C47S.2 C48A.2 C48B.2 C48C.2 C48D.2 C48E.2 C48S.2 C49A.2 C49B.2 C49C.2 C49D.2 C49E.2 C49S.2 C400.2 C401.2 C402.2 C403.2 C404.2 C405.2 C406.2 C407.2 C408.2 C409.2 C410.2 C411.2 C412.2 C413.2 C414.2 C415.2 C416.2 C417.2 C418.2 C419.2 C420.2 C421.2 C422.2 C423.2 C424.2 C425.2 C426.2 C427.2 C428.2 C429.2 C430.2 C431.2 C432.2 C433.2 C434.2 C435.2 C436.2 C437.2 C438.2 C439.2 C440.2 C441.2 C442.2 C443.2 C444.2 C445.2 C446.2 C447.2 C448.2 C449.2 C450.2 C451.2 C452.2 C453.2 C454.2 C455.2 C456.2 C457.2 C458.2 C459.2 C460.2 C461.2 C462.2 C463.2 C464.2 C465.2 C466.2 C467.2 C468.2 C469.2 C470.2 C471.2 C472.2 C473.2 C474.2 C475.2 C476.2 C477.2 C478.2 C479.2 C480.2 C481.2 C482.2 C483.2 C484.2 C485.2 C486.2 C487.2 C488.2 C489.2 C490.2 C491.2 C492.2 C493.2 C494.2 C495.2 C496.2 C497.2 C498.2 C499.2 ; also sheet 1,2
VDD_0V9: C4A0.1 C4A1.1 C4A2.1 C4A3.1 C4A4.1 C4A5.1 C4A6.1 C4A7.1 C4A8.1 C4A9.1 C4AA.1 C4AB.1 C4AC.1 C4AD.1 C4AE.1 C4AS.1 C4B0.1 C4B1.1 C4B2.1 C4B3.1 C4B4.1 C4B5.1 C4B6.1 C4B7.1 C4B8.1 C4B9.1 C4BA.1 C4BB.1 C4BC.1 C4BD.1 C4BE.1 C4BS.1 C4C0.1 C4C1.1 C4C2.1 C4C3.1 C4C4.1 C4C5.1 C4C6.1 C4C7.1 C4C8.1 C4C9.1 C4CA.1 C4CB.1 C4CC.1 C4CD.1 C4CE.1 C4CS.1 C4D0.1 C4D1.1 C4D2.1 C4D3.1 C4D4.1 C4D5.1 C4D6.1 C4D7.1 C4D8.1 C4D9.1 C4DA.1 C4DB.1 C4DC.1 C4DD.1 C4DE.1 C4DS.1 C4E0.1 C4E1.1 C4E2.1 C4E3.1 C4E4.1 C4E5.1 C4E6.1 C4E7.1 C4E8.1 C4E9.1 C4EA.1 C4EB.1 C4EC.1 C4ED.1 C4EE.1 C4ES.1 C4F0.1 C4F1.1 C4F2.1 C4F3.1 C4F4.1 C4F5.1 C4F6.1 C4F7.1 C4F8.1 C4F9.1 C4FA.1 C4FB.1 C4FC.1 C4FD.1 C4FE.1 C4FS.1 C4GS.1 C4HS.1 C4IS.1 C4JS.1 C4KS.1 C4LS.1 C4MS.1 C4NS.1 C4OS.1 C4PS.1 C4QS.1 C4RS.1 C4SS.1 C4TS.1 C4US.1 C4VS.1 C40A.1 C40B.1 C40C.1 C40D.1 C40E.1 C40S.1 C41A.1 C41B.1 C41C.1 C41D.1 C41E.1 C41S.1 C42A.1 C42B.1 C42C.1 C42D.1 C42E.1 C42S.1 C43A.1 C43B.1 C43C.1 C43D.1 C43E.1 C43S.1 C44A.1 C44B.1 C44C.1 C44D.1 C44E.1 C44S.1 C45A.1 C45B.1 C45C.1 C45D.1 C45E.1 C45S.1 C46A.1 C46B.1 C46C.1 C46D.1 C46E.1 C46S.1 C47A.1 C47B.1 C47C.1 C47D.1 C47E.1 C47S.1 C48A.1 C48B.1 C48C.1 C48D.1 C48E.1 C48S.1 C49A.1 C49B.1 C49C.1 C49D.1 C49E.1 C49S.1 C400.1 C401.1 C402.1 C403.1 C404.1 C405.1 C406.1 C407.1 C408.1 C409.1 C410.1 C411.1 C412.1 C413.1 C414.1 C415.1 C416.1 C417.1 C418.1 C419.1 C420.1 C421.1 C422.1 C423.1 C424.1 C425.1 C426.1 C427.1 C428.1 C429.1 C430.1 C431.1 C432.1 C433.1 C434.1 C435.1 C436.1 C437.1 C438.1 C439.1 C440.1 C441.1 C442.1 C443.1 C444.1 C445.1 C446.1 C447.1 C448.1 C449.1 C450.1 C451.1 C452.1 C453.1 C454.1 C455.1 C456.1 C457.1 C458.1 C459.1 C460.1 C461.1 C462.1 C463.1 C464.1 C465.1 C466.1 C467.1 C468.1 C469.1 C470.1 C471.1 C472.1 C473.1 C474.1 C475.1 C476.1 C477.1 C478.1 C479.1 C480.1 C481.1 C482.1 C483.1 C484.1 C485.1 C486.1 C487.1 C488.1 C489.1 C490.1 C491.1 C492.1 C493.1 C494.1 C495.1 C496.1 C497.1 C498.1 C499.1 ; supply symbol labelled VCC_0V9 ; also sheet 1,2

### Notes on the sheet
- F#228-0800
- ALL CAPACITORS 1U
- 6V3/X5R
- ASIC DECOUPLING
- F#:1759-367
- GLOBAL DECOUPLING | 6V3/Y5V
- * PINNING | : OK
- * FUNCTIONALITY | : OK
- * PHYSICAL SIZE | : OK
- bitfury H-CARD - decoupling
- * IN HOUSE | : OK
- * LAID OUT | : OK | 130624 | 1.0
- * COMPS IN LIB | : OK

## Library data of the parts
C01-C04 C4AS C4BS C4CS C4DS C4ES C4FS C4GS C4HS C4IS C4JS C4KS C4LS C4MS C4NS C4OS C4PS C4QS C4RS C4SS C4TS C4US C4VS C12-C16 C40S C41S C42S C43S C44S C45S C46S C47S C48S C49S = 00-own_parts:CAP1210
C01B C01L C01R C01S C05 C10F = 00-own_parts:CAP0603
C01P = 00-own_parts:CAP0805
C4A0 C4A1-C4A9 C4AA C4AB C4AC C4AD C4AE C4B0 C4B1-C4B9 C4BA C4BB C4BC C4BD C4BE C4C0 C4C1-C4C9 C4CA C4CB C4CC C4CD C4CE C4D0 C4D1-C4D9 C4DA C4DB C4DC C4DD C4DE C4E0 C4E1-C4E9 C4EA C4EB C4EC C4ED C4EE C4F0 C4F1-C4F9 C4FA C4FB C4FC C4FD C4FE C40A C40B C40C C40D C40E C41A C41B C41C C41D C41E C42A C42B C42C C42D C42E C43A C43B C43C C43D C43E C44A C44B C44C C44D C44E C45A C45B C45C C45D C45E C46A C46B C46C C46D C46E C47A C47B C47C C47D C47E C48A C48B C48C C48D C48E C49A C49B C49C C49D C49E C400-C499 = 00-own_parts:CAP0402
C06 = 00-bitfury:ECAP_CASED: Capacitor, electrolyte, diam. 6.3 x 5.8, case D
F01I = 00-own_parts:POLYFUSE2920
FI1-FI3 = 00-own_parts:FIDUCIAL: Fiducial Alignment Points Various fiducial points for machine vision alignment.
H1-H6 = 00-own_parts:HOLE_NPTH_3.2MM: Hole, NPTH, 3.2mm
J01 = 00-bitfury:CON_EDGE_2X10: Connector, edhe type, gold plated contacts
L01 = 00-bitfury:PA0513.441NLT: Inductor, 440NH, 30A, 0.32R
L01I = 00-bitfury:L2220: Inductor, 2220, chip ferrite bead
R01B R01E R01F R01L R01M R01R R01S R01T R01T1 R02E R02F = 00-own_parts:RES
SJ1-SJ64 = 00-own_parts:SJ2
U01 = 00-bitfury:TPS53355: DC/DC converterr, 0V6..5V5/30A, F#205-7099
U4A U4B U4C U4D U4E U4F U40-U49 = 00-bitfury:BITFURY: MCU, Bitfury SHA256 Bitcoin hasher, 5GH/s, QNF48